# Altium project S3220B.PrjPcb
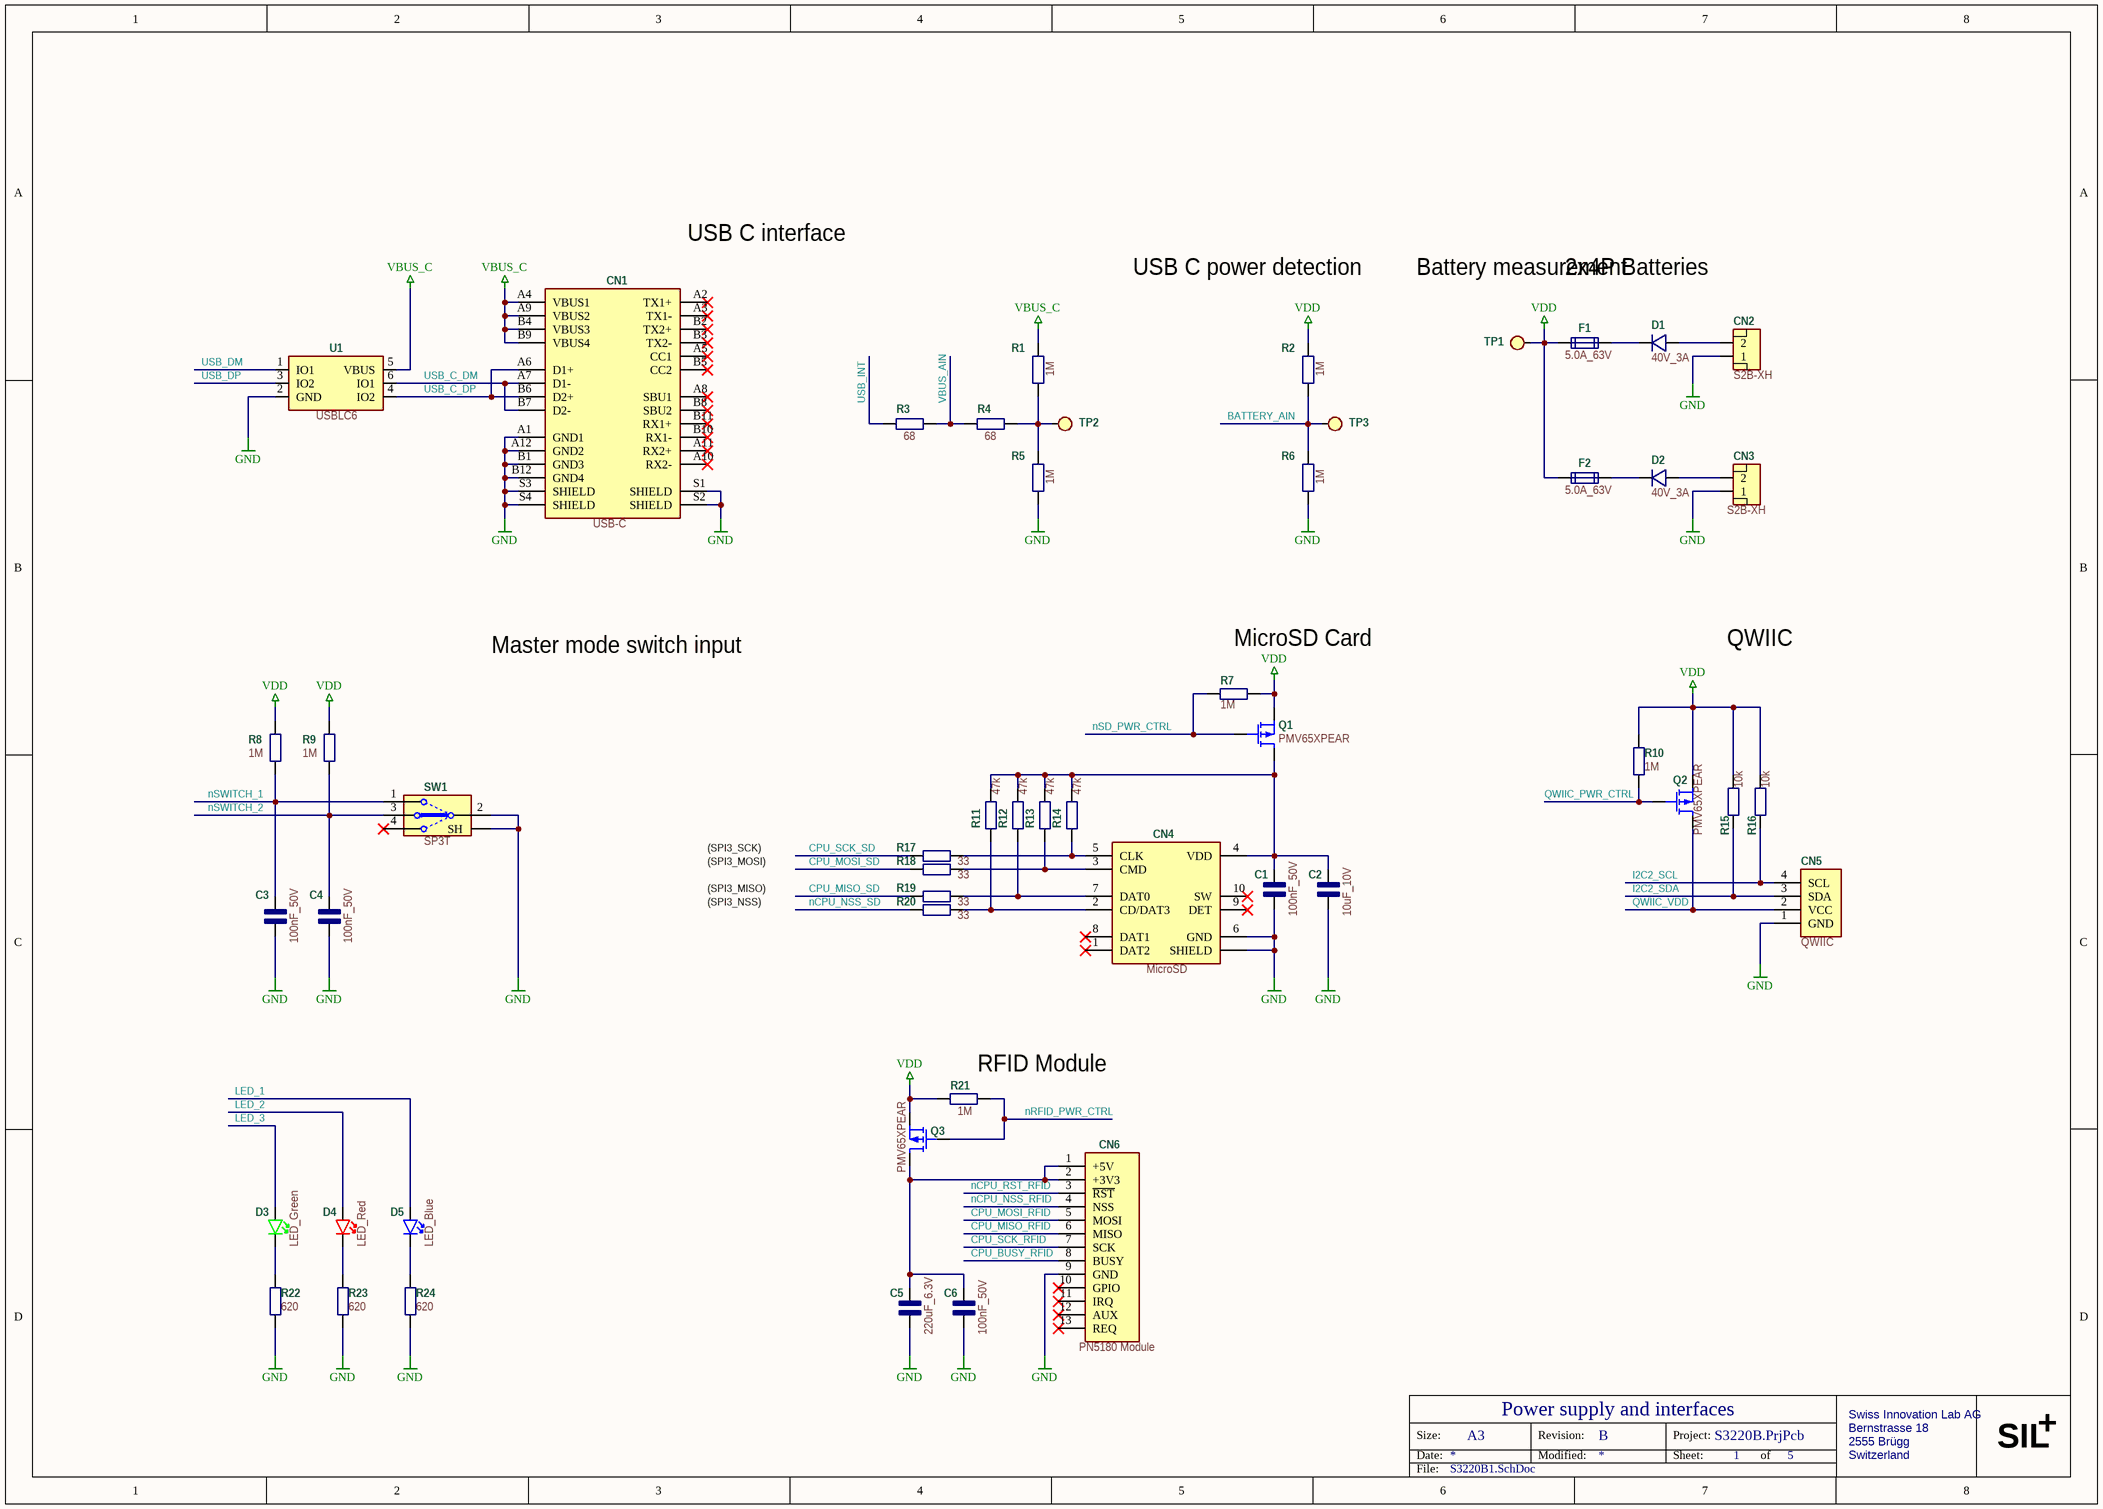
[diagram p0: S3220B1.SchDoc]
4 sheets, 235 parts. Net scope: global (net labels, ports and power ports of the same name join across sheets).
Board files: S3220B.PcbDoc, Panelized_S3220B.PcbDoc
Sheets:
  S3220B1.SchDoc
  S3220B2.SchDoc
  S3220B3.SchDoc
  S3220B4.SchDoc

## Sheet S3220B1.SchDoc: Power supply and interfaces
size A3; Revision: B; SheetNumber: 1; SheetTotal: 5

### Parts
C1  100nF_50V  [C_0603]
C2  10uF_10V  [C_0603]
C3  100nF_50V  [C_0603]
C4  100nF_50V  [C_0603]
C5  220uF_6.3V  [C_1206]
C6  100nF_50V  [C_0603]
CN1  USB-C  [CN_USB-C-RA_2]
CN2  S2B-XH  [CN_S2B-XH-A]
CN3  S2B-XH  [CN_S2B-XH-A]
CN4  MicroSD  [CN_MicroSD-Holder]
CN5  QWIIC  [CN_SM04B-SRSS-TB]
CN6  PN5180 Module  [CN_RFID-PN5180]  (no BOM)
D1  40V_3A  [D_DO-214AC]
D2  40V_3A  [D_DO-214AC]
D3  LED_Green  [LED_2-SMD_4x4]
D4  LED_Red  [LED_2-SMD_4x4]
D5  LED_Blue  [LED_2-SMD_4x4]
F1  5.0A_63V  [F_1206]
F2  5.0A_63V  [F_1206]
Q1  PMV65XPEAR  [U_SOT23-3]
Q2  PMV65XPEAR  [U_SOT23-3]
Q3  PMV65XPEAR  [U_SOT23-3]
R1  1M  [R_0603]
R2  1M  [R_0603]
R3  68  [R_0603]
R4  68  [R_0603]
R5  1M  [R_0603]
R6  1M  [R_0603]
R7  1M  [R_0603]
R8  1M  [R_0603]
R9  1M  [R_0603]
R10  1M  [R_0603]
R11  47k  [R_0603]
R12  47k  [R_0603]
R13  47k  [R_0603]
R14  47k  [R_0603]
R15  10k  [R_0603]
R16  10k  [R_0603]
R17  33  [R_0603]
R18  33  [R_0603]
R19  33  [R_0603]
R20  33  [R_0603]
R21  1M  [R_0603]
R22  620  [R_0603]
R23  620  [R_0603]
R24  620  [R_0603]
SW1  SP3T  [SW_SLIDE-SP3T]
TP1  Test point  [TP_SMD_R1.0mm]  (value not drawn)  (no BOM)
TP2  Test point  [TP_SMD_R1.0mm]  (value not drawn)  (no BOM)
TP3  Test point  [TP_SMD_R1.0mm]  (value not drawn)  (no BOM)
U1  USBLC6  [U_SOT23-6]

### Nets
GND: C1.1 C2.1 C3.1 C4.1 C5.1 C6.1 CN1.A1(GND1) CN1.A12(GND2) CN1.B1(GND3) CN1.B12(GND4) CN1.S1(SHIELD) CN1.S2(SHIELD) CN1.S3(SHIELD) CN1.S4(SHIELD) CN2.1 CN3.1 CN4.0(SHIELD) CN4.6(GND) CN5.1(GND) CN6.9(GND) R5.1 R6.1 R22.2 R23.2 R24.2 SW1.0(SH) SW1.2 U1.2(GND)
VBUS_C: CN1.A4(VBUS1) CN1.A9(VBUS2) CN1.B4(VBUS3) CN1.B9(VBUS4) R1.2 U1.5(VBUS)
VDD: F1.1 F2.1 Q1.2(S) Q2.2(S) Q3.2(S) R2.2 R7.1 R8.2 R9.2 R10.2 R15.2 R16.2 R21.1 TP1.1
BATTERY_AIN: R2.1 R6.2 TP3.1
CPU_BUSY_RFID: CN6.8(BUSY)
CPU_MISO_RFID: CN6.6(MISO)
CPU_MISO_SD: R19.1
CPU_MOSI_RFID: CN6.5(MOSI)
CPU_MOSI_SD: R18.1
CPU_SCK_RFID: CN6.7(SCK)
CPU_SCK_SD: R17.1
I2C2_SCL: CN5.4(SCL) R16.1
I2C2_SDA: CN5.3(SDA) R15.1
LED_1: D5.1(A)
LED_2: D4.1(A)
LED_3: D3.1(A)
nCPU_NSS_RFID: CN6.4(NSS)
nCPU_NSS_SD: R20.1
nCPU_RST_RFID: CN6.3(~{RST})
nRFID_PWR_CTRL: Q3.1(G) R21.2
nSD_PWR_CTRL: Q1.1(G) R7.2
nSWITCH_1: C3.2 R8.1 SW1.1
nSWITCH_2: C4.2 R9.1 SW1.3
QWIIC_PWR_CTRL: Q2.1(G) R10.1
QWIIC_VDD: CN5.2(VCC) Q2.3(D)
USB_C_DM: CN1.A7(D1-) CN1.B7(D2-) U1.6(IO1)
USB_C_DP: CN1.A6(D1+) CN1.B6(D2+) U1.4(IO2)
USB_DM: U1.1(IO1)
USB_DP: U1.3(IO2)
USB_INT: R3.1
VBUS_AIN: R3.2 R4.1
NetC1_2: C1.2 C2.2 CN4.4(VDD) Q1.3(D) R11.2 R12.2 R13.2 R14.2
NetC5_2: C5.2 C6.2 CN6.1(+5V) CN6.2(+3V3) Q3.3(D)
NetCN2_2: CN2.2 D1.A
NetCN3_2: CN3.2 D2.A
NetCN4_2: CN4.2(CD/DAT3) R11.1 R20.2
NetCN4_3: CN4.3(CMD) R13.1 R18.2
NetCN4_5: CN4.5(CLK) R14.1 R17.2
NetCN4_7: CN4.7(DAT0) R12.1 R19.2
NetD1_K: D1.K F1.2
NetD2_K: D2.K F2.2
NetD3_2: D3.2(K) R22.1
NetD4_2: D4.2(K) R23.1
NetD5_2: D5.2(K) R24.1
NetR1_1: R1.1 R4.2 R5.2 TP2.1

Not connected (* = marked no-connect by the designer): CN1 A2(TX1+)* A3(TX1-)* A5(CC1)* A8(SBU1)* A10(RX2-)* A11(RX2+)* B2(TX2+)* B3(TX2-)* B5(CC2)* B8(SBU2)* B10(RX1-)* B11(RX1+)*; CN4 1(DAT2)* 8(DAT1)* 9(DET)* 10(SW)* X1 X2; CN6 10(GPIO)* 11(IRQ)* 12(AUX)* 13(REQ)*; SW1 4*

### Notes on the sheet
- USB C interface
- USB C power detection
- Battery measurement
- 2x4P Batteries
- (near R7) MicroSD Card
- QWIIC
- Master mode switch input
- (SPI3_SCK)
- (SPI3_NSS)
- (SPI3_MISO)
- (SPI3_MOSI)
- (near R21) RFID Module
- Size:
- Date:
- A3
- Revision:
- Modified:
- Project:
- Sheet:
- of
- Swiss Innovation Lab AG
- Bernstrasse 18
- 2555 Brügg
- Switzerland
- SIL
- +
- File:

### Library data of the parts
C1 C3 C4 C6 = C_100nF_50V: 0.1µF ±10% 50V Ceramic Capacitor X7R 0603 (1608 Metric); Manufacturer: TDK; Manufacturer Part Number: C1608X7R1H104K080AA; Value: 100nF; ValueAux: _50V; Currency: $; Price: 0,01309; Supplier 1: Digi-Key; Supplier Part Number 1: 445-1314-6-ND
C2 = C_10uF_10V: 10µF ±10% 10V Ceramic Capacitor X5R 0603 (1608 Metric); Manufacturer: Murata Electronics North America; Manufacturer Part Number: GRM188R61A106KE69D; Value: 10uF; ValueAux: _10V; Currency: $; Price: 0,03994; Supplier 1: Digi-Key; Supplier Part Number 1: 490-10474-1-ND
C5 = C_220uF_6.3V: 220µF ±20% 6.3V Ceramic Capacitor X5R 1206 (3216 Metric); Manufacturer: Murata Electronics North America; Manufacturer Part Number: GRM31CR60J227ME11L; Value: 220uF; ValueAux: _6.3V; Currency: $; Price: 0,59945; Supplier 1: Digi-Key; Supplier Part Number 1: 490-13970-1-ND
CN1 = CN_USB-C-RA_2: USB-C (USB TYPE-C) USB 3.2 Gen 2 (USB 3.1 Gen 2, Superspeed + (USB 3.1)) Receptacle Connector 24 Position Surface Mount, Right Angle; Through Hole; Manufacturer: CUI Devices; Manufacturer Part Number: UJ31-CH-G-SMT-TR-67; Currency: $; Value: USB-C; Price: 2,43252; Supplier 1: Digi-Key; Supplier Part Number 1: 2223-UJ31-CH-G-SMT-TR-67CT-ND
CN2 CN3 = CN_S2B-XH: Connector Header Through Hole, Right Angle 2 position 0.098" (2.50mm); Manufacturer: JST Sales America Inc.; Manufacturer Part Number: S2B-XH-A(LF)(SN); Currency: $; Supplier 1: Digi-Key; Supplier Part Number 1: 455-2257-ND; Value: S2B-XH; Price: 0,07792
CN4 = CN_MicroSD-Holder: 10 (8 + 2) Position Card Connector Secure Digital microSD Surface Mount, Right Angle Gold; Manufacturer: Molex; Manufacturer Part Number: 5031821852; Currency: $; Value: MicroSD; Price: 2,94830; Supplier 1: Digi-Key; Supplier Part Number 1: WM12834CT-ND
CN5 = CN_QWICC: Connector Header Surface Mount, Right Angle 4 position 0.039" (1.00mm); Manufacturer: JST Sales America Inc.; Manufacturer Part Number: SM04B-SRSS-TB(LF)(SN); Currency: $; Supplier 1: Digi-Key; Supplier Part Number 1: 455-1804-1-ND; Value: QWIIC; Price: 0,61
CN6 = CN_RFID-PN5180: RFID Module PN5180; Manufacturer: Swiss Innovation Lab; Currency: $; Manufacturer Part Number: RFID-PN5180; Supplier 1: Swiss Innovation Lab; Supplier Part Number 1: RFID-PN5180; Value: PN5180 Module; Price: 5
D1 D2 = D_40V_3A: Diode Schottky 40V 3A Surface Mount DO-214AC (SMA); Manufacturer: Comchip Technology; Manufacturer Part Number: CDBA340L-HF; ValueAux: _3A; Currency: $; Value: 40V; Price: 0,25740; Supplier 1: Digi-Key; Supplier Part Number 1: 641-1702-6-ND
D3 = D_LED_G_2mA: Green 570nm LED Indication - Discrete 1.8V 2-SMD, Boomerang; Manufacturer: OSRAM Opto Semiconductors Inc.; Manufacturer Part Number: LG A67K-G2K1-24-0-2-R33-Z; ValueAux: _Green; Currency: $; Value: LED; Price: 0,10408; Supplier 1: Digi-Key; Supplier Part Number 1: 475-LGA67K-G2K1-24-0-2-R33-ZTR-ND
D4 = D_LED_R_2mA: Red 630nm LED Indication - Discrete 1.8V 2-SMD, Boomerang; Manufacturer: OSRAM Opto Semiconductors Inc.; Manufacturer Part Number: LS A67K-J1K2-1-Z; ValueAux: _Red; Currency: $; Value: LED; Price: 0,10626; Supplier 1: Digi-Key; Supplier Part Number 1: 475-3123-1-ND
D5 = D_LED_B_10mA: Blue 471nm LED Indication - Discrete 3.1V 2-SMD, Boomerang; Manufacturer: OSRAM Opto Semiconductors Inc.; Manufacturer Part Number: LB A673-L2N1-35-Z; ValueAux: _Blue; Currency: $; Value: LED; Price: 0,11695; Supplier 1: Digi-Key; Supplier Part Number 1: LBA673-L2N1-35-Z-ND
F1 F2 = F_5A_63V: FUSE BOARD MNT 5A 63VAC/VDC 1206; Manufacturer: Bel Fuse Inc.; Manufacturer Part Number: C1S 5; Value: 5.0A; ValueAux: _63V; Currency: $; Price: 0,17995; Supplier 1: Digi-Key; Supplier Part Number 1: 507-1194-1-ND
Q1-Q3 = Q_PMV65: P-Channel 20V 2.8A (Ta) 480mW (Ta), 6.25W (Tc) Surface Mount TO-236AB (SOT23); Manufacturer: Nexperia USA Inc.; Currency: $; Value: PMV65XPEAR; Manufacturer Part Number: PMV65XPEAR; Price: 0,11204; Supplier 1: Digi-Key; Supplier Part Number 1: 1727-2310-1-ND
R1 R2 R5-R10 R21 = R_1M_1%: 1 MOhms ±1% 0.1W, 1/10W Chip Resistor 0603 (1608 Metric) Automotive AEC-Q200 Thick Film; Manufacturer: Panasonic Electronic Components; Manufacturer Part Number: ERJ-3EKF1004V; Currency: $; Value: 1M; Price: 0,01264; Supplier 1: Digi-Key; Supplier Part Number 1: P1.00MHCT-ND
R3 R4 = R_68_1%: 68 Ohms ±1% 0.1W, 1/10W Chip Resistor 0603 (1608 Metric) Automotive AEC-Q200 Thick Film; Manufacturer: Panasonic Electronic Components; Manufacturer Part Number: ERJ-3EKF68R0V; Currency: $; Value: 68; Price: 0,01449; Supplier 1: Digi-Key; Supplier Part Number 1: P68.0HCT-ND
R11-R14 = R_47k_1%: 47 kOhms ±1% 0.1W, 1/10W Chip Resistor 0603 (1608 Metric) Automotive AEC-Q200 Thick Film; Manufacturer: Panasonic Electronic Components; Manufacturer Part Number: ERJ-3EKF4702V; Currency: $; Value: 47k; Price: 0,00670; Supplier 1: Digi-Key; Supplier Part Number 1: P47.0KHCT-ND
R15 R16 = R_10k_1%: 10 kOhms ±1% 0.1W, 1/10W Chip Resistor 0603 (1608 Metric) Automotive AEC-Q200 Thick Film; Manufacturer: Panasonic Electronic Components; Manufacturer Part Number: ERJ-3EKF1002V; Currency: $; Value: 10k; Price: 0,01449; Supplier 1: Digi-Key; Supplier Part Number 1: P10.0KHCT-ND
R17-R20 = R_33_1%: 33 Ohms ±1% 0.1W, 1/10W Chip Resistor 0603 (1608 Metric) Automotive AEC-Q200 Thick Film; Manufacturer: Panasonic Electronic Components; Manufacturer Part Number: ERJ-3EKF33R0V; Currency: $; Value: 33; Price: 0,01449; Supplier 1: Digi-Key; Supplier Part Number 1: P33.0HCT-ND
R22-R24 = R_620_1%: 620 Ohms ±1% 0.1W, 1/10W Chip Resistor 0603 (1608 Metric) Automotive AEC-Q200 Thick Film; Manufacturer: Panasonic Electronic Components; Manufacturer Part Number: ERJ-3EKF6200V; Currency: $; Value: 620; Price: 0,01273; Supplier 1: Digi-Key; Supplier Part Number 1: P620HCT-ND
SW1 = SW_SP3T_Slide: Slide Switch SP3T Through Hole, Right Angle; Manufacturer: C&K; Manufacturer Part Number: OS103011MA7QP1; Currency: $; Value: SP3T; Price: 0,42483; Supplier 1: Digi-Key; Supplier Part Number 1: CKN9561-ND
TP1-TP3 = TP_Test_point: Manufacturer: Swiss Innovation Lab; Currency: $; Value: Test point; Manufacturer Part Number: Test point; Price: 0
U1 = U_USBLC6: TVS DIODE 5.25V 17V SOT23-6; Manufacturer: STMicroelectronics; Manufacturer Part Number: USBLC6-2SC6Y; Currency: $; Value: USBLC6; Price: 0,33501; Supplier 1: Digi-Key; Supplier Part Number 1: 497-11882-6-ND

## Sheet S3220B2.SchDoc: CPU
size A3; Revision: B; SheetNumber: 2; SheetTotal: 5
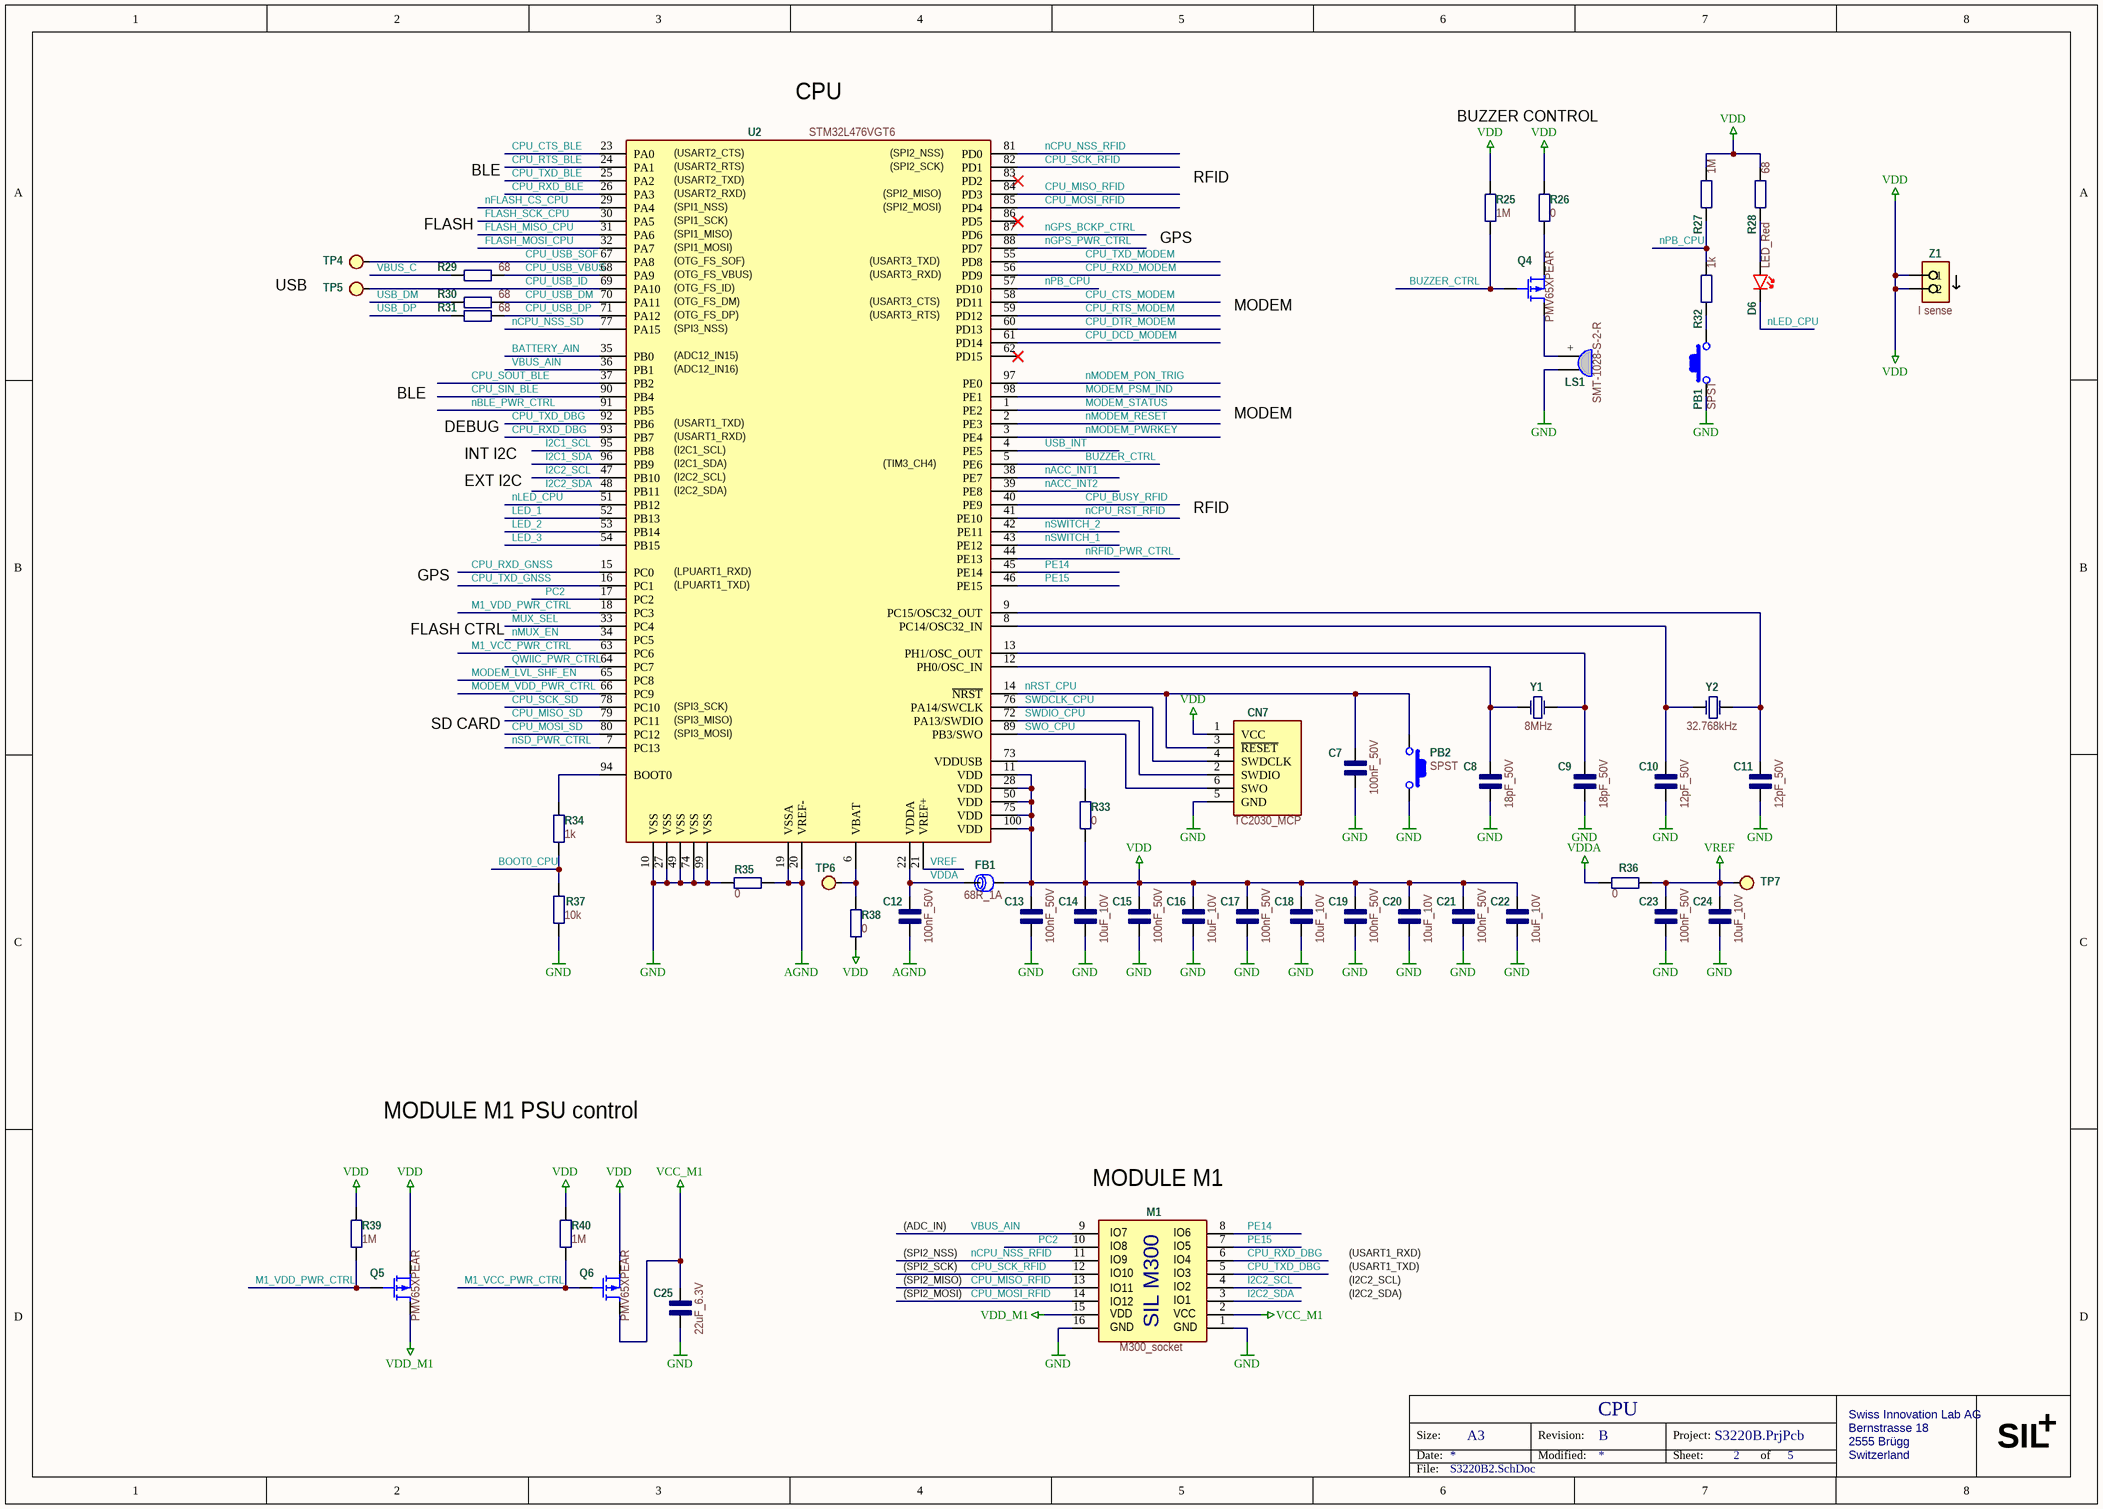
[diagram p1: S3220B2.SchDoc]

### Parts
C7  100nF_50V  [C_0603]
C8  18pF_50V  [C_0603]
C9  18pF_50V  [C_0603]
C10  12pF_50V  [C_0603]
C11  12pF_50V  [C_0603]
C12  100nF_50V  [C_0603]
C13  100nF_50V  [C_0603]
C14  10uF_10V  [C_0603]
C15  100nF_50V  [C_0603]
C16  10uF_10V  [C_0603]
C17  100nF_50V  [C_0603]
C18  10uF_10V  [C_0603]
C19  100nF_50V  [C_0603]
C20  10uF_10V  [C_0603]
C21  100nF_50V  [C_0603]
C22  10uF_10V  [C_0603]
C23  100nF_50V  [C_0603]
C24  10uF_10V  [C_0603]
C25  22uF_6.3V  [C_0603]
CN7  TC2030_MCP  [CN_TC2030-MCP-NL]  (no BOM)
D6  LED_Red  [LED_0603]
FB1  68R_1A  [L_0603]
LS1  SMT-1028-S-2-R  [LS_SMT-1028-S-2-R]
M1  M300_socket  [M_M300_socket]  (no BOM)
PB1  SPST  [PB_PTS810]
PB2  SPST  [PB_PTS810]
Q4  PMV65XPEAR  [U_SOT23-3]
Q5  PMV65XPEAR  [U_SOT23-3]
Q6  PMV65XPEAR  [U_SOT23-3]
R25  1M  [R_0603]
R26  0  [R_0603]
R27  1M  [R_0603]
R28  68  [R_0603]
R29  68  [R_0603]
R30  68  [R_0603]
R31  68  [R_0603]
R32  1k  [R_0603]
R33  0  [R_0603]
R34  1k  [R_0603]
R35  0  [R_0603]
R36  0  [R_0603]
R37  10k  [R_0603]
R38  0  [R_0603]
R39  1M  [R_0603]
R40  1M  [R_0603]
TP4  Test point  [TP_SMD_R1.0mm]  (value not drawn)  (no BOM)
TP5  Test point  [TP_SMD_R1.0mm]  (value not drawn)  (no BOM)
TP6  Test point  [TP_SMD_R1.0mm]  (value not drawn)  (no BOM)
TP7  Test point  [TP_SMD_R1.0mm]  (value not drawn)  (no BOM)
U2  STM32L476VGT6  [U_100-LQFP]
Y1  8MHz  [Y_ABMM2]
Y2  32.768kHz  [Y_XTAL-3215]
Z1  I sense  [Z_I_SENSE]  (no BOM)

### Nets
AGND: C12.1 R35.2 U2.19(VSSA) U2.20(VREF-)
GND: C7.1 C8.1 C9.1 C10.1 C11.1 C13.1 C14.1 C15.1 C16.1 C17.1 C18.1 C19.1 C20.1 C21.1 C22.1 C23.1 C24.1 C25.1 CN7.5(GND) LS1.2(-) M1.1(GND) M1.16(GND) PB1.2 PB2.1 R35.1 R37.1 U2.10(VSS) U2.27(VSS) U2.49(VSS) U2.74(VSS) U2.99(VSS)
VBUS_C: R29.1
VCC_M1: C25.2 M1.2(5V) Q6.3(D)
VDD: C13.2 C14.2 C15.2 C16.2 C17.2 C18.2 C19.2 C20.2 C21.2 C22.2 CN7.1(VCC) FB1.2 Q5.2(S) Q6.2(S) R25.2 R26.1 R27.1 R28.2 R33.2 R38.1 R39.2 R40.1 U2.11(VDD) U2.28(VDD) U2.50(VDD) U2.75(VDD) U2.100(VDD) Z1.1 Z1.2
VDD_M1: M1.15(3.3V) Q5.3(D)
VDDA: C12.2 FB1.1 R36.2 U2.22(VDDA)
VREF: C23.2 C24.2 R36.1 TP7.1 U2.21(VREF+)
BATTERY_AIN: U2.35(PB0)
BOOT0_CPU: R34.1 R37.2
BUZZER_CTRL: Q4.1(G) R25.1 U2.5(PE6)
CPU_BUSY_RFID: U2.40(PE9)
CPU_CTS_BLE: U2.23(PA0)
CPU_CTS_MODEM: U2.58(PD11)
CPU_DCD_MODEM: U2.61(PD14)
CPU_DTR_MODEM: U2.60(PD13)
CPU_MISO_RFID: M1.13(MISO) U2.84(PD3)
CPU_MISO_SD: U2.79(PC11)
CPU_MOSI_RFID: M1.14(MOSI) U2.85(PD4)
CPU_MOSI_SD: U2.80(PC12)
CPU_RTS_BLE: U2.24(PA1)
CPU_RTS_MODEM: U2.59(PD12)
CPU_RXD_BLE: U2.26(PA3)
CPU_RXD_DBG: M1.6(RX) U2.93(PB7)
CPU_RXD_GNSS: U2.15(PC0)
CPU_RXD_MODEM: U2.56(PD9)
CPU_SCK_RFID: M1.12(SCK) U2.82(PD1)
CPU_SCK_SD: U2.78(PC10)
CPU_SIN_BLE: U2.90(PB4)
CPU_SOUT_BLE: U2.37(PB2)
CPU_TXD_BLE: U2.25(PA2)
CPU_TXD_DBG: M1.5(TX) U2.92(PB6)
CPU_TXD_GNSS: U2.16(PC1)
CPU_TXD_MODEM: U2.55(PD8)
CPU_USB_DM: R30.2 U2.70(PA11)
CPU_USB_DP: R31.2 U2.71(PA12)
CPU_USB_ID: TP5.1 U2.69(PA10)
CPU_USB_SOF: TP4.1 U2.67(PA8)
CPU_USB_VBUS: R29.2 U2.68(PA9)
FLASH_MISO_CPU: U2.31(PA6)
FLASH_MOSI_CPU: U2.32(PA7)
FLASH_SCK_CPU: U2.30(PA5)
I2C1_SCL: U2.95(PB8)
I2C1_SDA: U2.96(PB9)
I2C2_SCL: M1.4(SCL) U2.47(PB10)
I2C2_SDA: M1.3(SDA) U2.48(PB11)
LED_1: U2.52(PB13)
LED_2: U2.53(PB14)
LED_3: U2.54(PB15)
M1_VCC_PWR_CTRL: Q6.1(G) R40.2 U2.63(PC6)
M1_VDD_PWR_CTRL: Q5.1(G) R39.1 U2.18(PC3)
MODEM_LVL_SHF_EN: U2.65(PC8)
MODEM_PSM_IND: U2.98(PE1)
MODEM_STATUS: U2.1(PE2)
MODEM_VDD_PWR_CTRL: U2.66(PC9)
MUX_SEL: U2.33(PC4)
nACC_INT1: U2.38(PE7)
nACC_INT2: U2.39(PE8)
nBLE_PWR_CTRL: U2.91(PB5)
nCPU_NSS_RFID: M1.11(CS) U2.81(PD0)
nCPU_NSS_SD: U2.77(PA15)
nCPU_RST_RFID: U2.41(PE10)
nFLASH_CS_CPU: U2.29(PA4)
nGPS_BCKP_CTRL: U2.87(PD6)
nGPS_PWR_CTRL: U2.88(PD7)
nLED_CPU: D6.2(K) U2.51(PB12)
nMODEM_PON_TRIG: U2.97(PE0)
nMODEM_PWRKEY: U2.3(PE4)
nMODEM_RESET: U2.2(PE3)
nMUX_EN: U2.34(PC5)
nPB_CPU: R27.2 R32.2 U2.57(PD10)
nRFID_PWR_CTRL: U2.44(PE13)
nRST_CPU: C7.2 CN7.3(~{RESET}) PB2.2 U2.14(~{NRST})
nSD_PWR_CTRL: U2.7(PC13)
nSWITCH_1: U2.43(PE12)
nSWITCH_2: U2.42(PE11)
PC2: M1.10(RST) U2.17(PC2)
PE14: M1.8(PWM) U2.45(PE14)
PE15: M1.7(INT) U2.46(PE15)
QWIIC_PWR_CTRL: U2.64(PC7)
SWDCLK_CPU: CN7.4(SWDCLK) U2.76(PA14/SWCLK)
SWDIO_CPU: CN7.2(SWDIO) U2.72(PA13/SWDIO)
SWO_CPU: CN7.6(SWO) U2.89(PB3/SWO)
USB_DM: R30.1
USB_DP: R31.1
USB_INT: U2.4(PE5)
VBUS_AIN: M1.9(AN) U2.36(PB1)
NetC8_2: C8.2 U2.12(PH0/OSC_IN) Y1.1(inp)
NetC9_2: C9.2 U2.13(PH1/OSC_OUT) Y1.3(out)
NetC10_2: C10.2 U2.8(PC14/OSC32_IN) Y2.1(inp)
NetC11_2: C11.2 U2.9(PC15/OSC32_OUT) Y2.2(out)
NetD6_1: D6.1(A) R28.1
NetLS1_1: LS1.1(+) Q4.3(D)
NetPB1_1: PB1.1 R32.1
NetQ4_2: Q4.2(S) R26.2
NetR33_1: R33.1 U2.73(VDDUSB)
NetR34_2: R34.2 U2.94(BOOT0)
NetR38_2: R38.2 TP6.1 U2.6(VBAT)

Not connected (* = marked no-connect by the designer): U2 62(PD15)* 83(PD2)* 86(PD5)*

### Notes on the sheet
- (near U2) CPU
- BLE
- (near U2) (USART2_TXD)
- (near U2) (USART2_CTS)
- (near U2) (USART2_RTS)
- (near U2) (SPI2_SCK)
- (near U2) (SPI2_NSS)
- RFID
- BUZZER CONTROL
- (near R29) FLASH
- (near U2) (USART2_RXD)
- (near U2) (SPI1_MISO)
- (near U2) (SPI1_SCK)
- (near U2) (SPI1_NSS)
- (near U2) (SPI2_MOSI)
- (near U2) (SPI2_MISO)
- GPS
- USB
- (near U2) (SPI1_MOSI)
- (near U2) (OTG_FS_DM)
- (near U2) (OTG_FS_DP)
- (near U2) (OTG_FS_SOF)
- (near U2) (OTG_FS_VBUS)
- (near U2) (OTG_FS_ID)
- (near U2) (USART3_CTS)
- (near U2) (USART3_RTS)
- (near U2) (USART3_TXD)
- (near U2) (USART3_RXD)
- MODEM
- (near U2) (SPI3_NSS)
- (near U2) (ADC12_IN15)
- (near U2) (ADC12_IN16)
- DEBUG
- (near U2) (USART1_TXD)
- (near U2) (USART1_RXD)
- (near U2) (I2C1_SCL)
- INT I2C
- EXT I2C
- (near U2) (I2C2_SCL)
- (near U2) (I2C2_SDA)
- (near U2) (I2C1_SDA)
- (near U2) (TIM3_CH4)
- (near U2) (LPUART1_TXD)
- (near U2) (LPUART1_RXD)
- FLASH CTRL
- (near U2) (SPI3_SCK)
- (near U2) (SPI3_MISO)
- SD CARD
- (near U2) (SPI3_MOSI)
- MODULE M1 PSU control
- (near M1) MODULE M1
- (SPI2_NSS)
- (ADC_IN)
- (USART1_RXD)
- (SPI2_SCK)
- (SPI2_MISO)
- (SPI2_MOSI)
- (I2C2_SCL)
- (I2C2_SDA)
- (USART1_TXD)
- Size:
- Date:
- A3
- Revision:
- Modified:
- Project:
- Sheet:
- of
- Swiss Innovation Lab AG
- Bernstrasse 18
- 2555 Brügg
- Switzerland
- SIL
- +
- File:
- (in symbol M_M300_socket) IO7; IO6; IO8; IO5; IO9; IO4; IO10; IO3; IO11; IO2; IO12; IO1; VDD; VCC; SIL M300

### Library data of the parts
C7 C12 C13 C15 C17 C19 C21 C23 = C_100nF_50V: as C1 on sheet S3220B1; Price: 0,01309; Supplier 1: Digi-Key; Supplier Part Number 1: 445-1314-6-ND
C8 C9 = C_18pF_50V: 18pF ±5% 50V Ceramic Capacitor C0G, NP0 0603 (1608 Metric); Manufacturer: KEMET; Manufacturer Part Number: C0603C180J5GACTU; ValueAux: _50V; Currency: $; Value: 18pF; Price: 0,00974; Supplier 1: Digi-Key; Supplier Part Number 1: 399-1052-1-ND
C10 C11 = C_12pF_50V: 12pF ±1% 50V Ceramic Capacitor C0G, NP0 0603 (1608 Metric); Manufacturer: Samsung Electro-Mechanics; Manufacturer Part Number: CL10C120FB8NNNC; ValueAux: _50V; Currency: $; Value: 12pF; Price: 0,05153; Supplier 1: Digi-Key; Supplier Part Number 1: 1276-2175-1-ND
C14 C16 C18 C20 C22 C24 = C_10uF_10V: as C2 on sheet S3220B1; Price: 0,03994; Supplier 1: Digi-Key; Supplier Part Number 1: 490-10474-1-ND
C25 = C_22uF_6V3: 22µF ±20% 6.3V Ceramic Capacitor X5R 0603 (1608 Metric); Manufacturer: Samsung Electro-Mechanics; Manufacturer Part Number: CL10A226MQ8NRNC; Value: 22uF; ValueAux: _6.3V; Currency: $; Price: 0,04566; Supplier 1: Digi-Key; Supplier Part Number 1: 1276-1193-1-ND
CN7 = CN_TC2030: TC2030-MCP-NL; Value: TC2030; ValueAux: _MCP; Currency: $; Price: 0
D6 = D_LED_R_5mA: Red 631nm LED Indication - Discrete 2V 0603; Manufacturer: Lite-On Inc.; Manufacturer Part Number: LTST-C193KRKT-5A; ValueAux: _Red; Currency: $; Value: LED; Price: 0,07565; Supplier 1: Digi-Key; Supplier Part Number 1: 160-1830-1-ND
FB1 = FB_68R_1A: FERRITE BEAD 68 OHM 0603 1LN; Manufacturer: Laird-Signal Integrity Products; Manufacturer Part Number: MI0603J680R-10; Value: 68R; ValueAux: _1A; Currency: $; Price: 0,02658; Supplier 1: Digi-Key; Supplier Part Number 1: 240-2372-1-ND
LS1 = LS_SMT-1028-S-2-R: Buzzers Transducer, Externally Driven Electromechanical/Magnetic 3.6 V 100mA 2.83kHz 93dB @ 3.6V, 10cm Surface Mount Solder Pads; Manufacturer: PUI Audio, Inc.; Currency: $; Value: SMT-1028-S-2-R; Manufacturer Part Number: SMT-1028-S-2-R; Price: 1,99500; Supplier 1: Digi-Key; Supplier Part Number 1: 668-1531-1-ND
M1 = M_M300_socket: Module M300 motherboard socket; Manufacturer: Swiss Innovation Lab; Currency: $; Value: M300; ValueAux: _socket; Manufacturer Part Number: M300; Price: 0; Supplier 1: Swiss Innovation Lab; Supplier Part Number 1: M300
PB1 PB2 = PB_SPST_2.5mm: Tactile Switch SPST-NO Top Actuated Surface Mount; Manufacturer: C&K; Manufacturer Part Number: PTS810 SJM 250 SMTR LFS; Currency: $; Value: SPST; Price: 0,17302; Supplier 1: Digi-Key; Supplier Part Number 1: CKN10502DKR-ND
Q4-Q6 = Q_PMV65: as Q1 on sheet S3220B1; Value: PMV65XPEAR; Manufacturer Part Number: PMV65XPEAR; Price: 0,11204; Supplier 1: Digi-Key; Supplier Part Number 1: 1727-2310-1-ND
R25 R27 R39 R40 = R_1M_1%: as R1 on sheet S3220B1; Value: 1M; Price: 0,01264; Supplier 1: Digi-Key; Supplier Part Number 1: P1.00MHCT-ND
R26 R33 R35 R36 R38 = R_0_1%: 0 Ohms Jumper 0.1W, 1/10W Chip Resistor 0603 (1608 Metric) Automotive AEC-Q200 Thick Film; Manufacturer: Panasonic Electronic Components; Manufacturer Part Number: ERJ-3GEY0R00V; Currency: $; Value: 0; Price: 0,00962; Supplier 1: Digi-Key; Supplier Part Number 1: P0.0GCT-ND
R28-R31 = R_68_1%: as R3 on sheet S3220B1; Value: 68; Price: 0,01449; Supplier 1: Digi-Key; Supplier Part Number 1: P68.0HCT-ND
R32 R34 = R_1k_1%: 1 kOhms ±1% 0.1W, 1/10W Chip Resistor 0603 (1608 Metric) Automotive AEC-Q200 Thick Film; Manufacturer: Panasonic Electronic Components; Manufacturer Part Number: ERJ-3EKF1001V; Currency: $; Value: 1k; Price: 0,01153; Supplier 1: Digi-Key; Supplier Part Number 1: P1.00KHCT-ND
R37 = R_10k_1%: as R15 on sheet S3220B1; Value: 10k; Price: 0,01449; Supplier 1: Digi-Key; Supplier Part Number 1: P10.0KHCT-ND
TP4-TP7 = TP_Test_point: as TP1 on sheet S3220B1; Value: Test point; Manufacturer Part Number: Test point; Price: 0
U2 = U_STM32L476: ARM® Cortex®-M4 STM32L4 Microcontroller IC 32-Bit 80MHz 1MB (1M x 8) FLASH 100-LQFP (14x14); Manufacturer: STMicroelectronics; Currency: $; Value: STM32L476VGT6; Manufacturer Part Number: STM32L476VGT6; Price: 5,98590; Supplier 1: Digi-Key; Supplier Part Number 1: 497-15873-ND
Y1 = Y_8MHz_20ppm: 8MHz ±20ppm Crystal 18pF 72 Ohms 4-SMD, No Lead; Manufacturer: Abracon LLC; Manufacturer Part Number: ABMM2-8.000MHZ-E2-T; Currency: $; Value: 8MHz; Price: 0,49500; Supplier 1: Digi-Key; Supplier Part Number 1: 535-9628-1-ND
Y2 = Y_32kHz_10ppm: 32.768kHz ±10ppm Crystal 12.5pF 70 kOhms 2-SMD, No Lead; Manufacturer: ECS Inc.; Manufacturer Part Number: ECS-.327-12.5-34B-C-TR; Currency: $; Value: 32.768kHz; Price: 0,42900; Supplier 1: Digi-Key; Supplier Part Number 1: XC1968CT-ND
Z1 = Z_I_sense: 2 Positions Header Connector 0.100" (2.54mm) SMD Gold for current measurement; Manufacturer: SIL; Currency: $; Value: I sense; Manufacturer Part Number: I sense; Price: 0; Supplier 1: SIL; Supplier Part Number 1: I sense

## Sheet S3220B3.SchDoc: Modem BG95
size A3; Revision: B; SheetNumber: 3; SheetTotal: 5
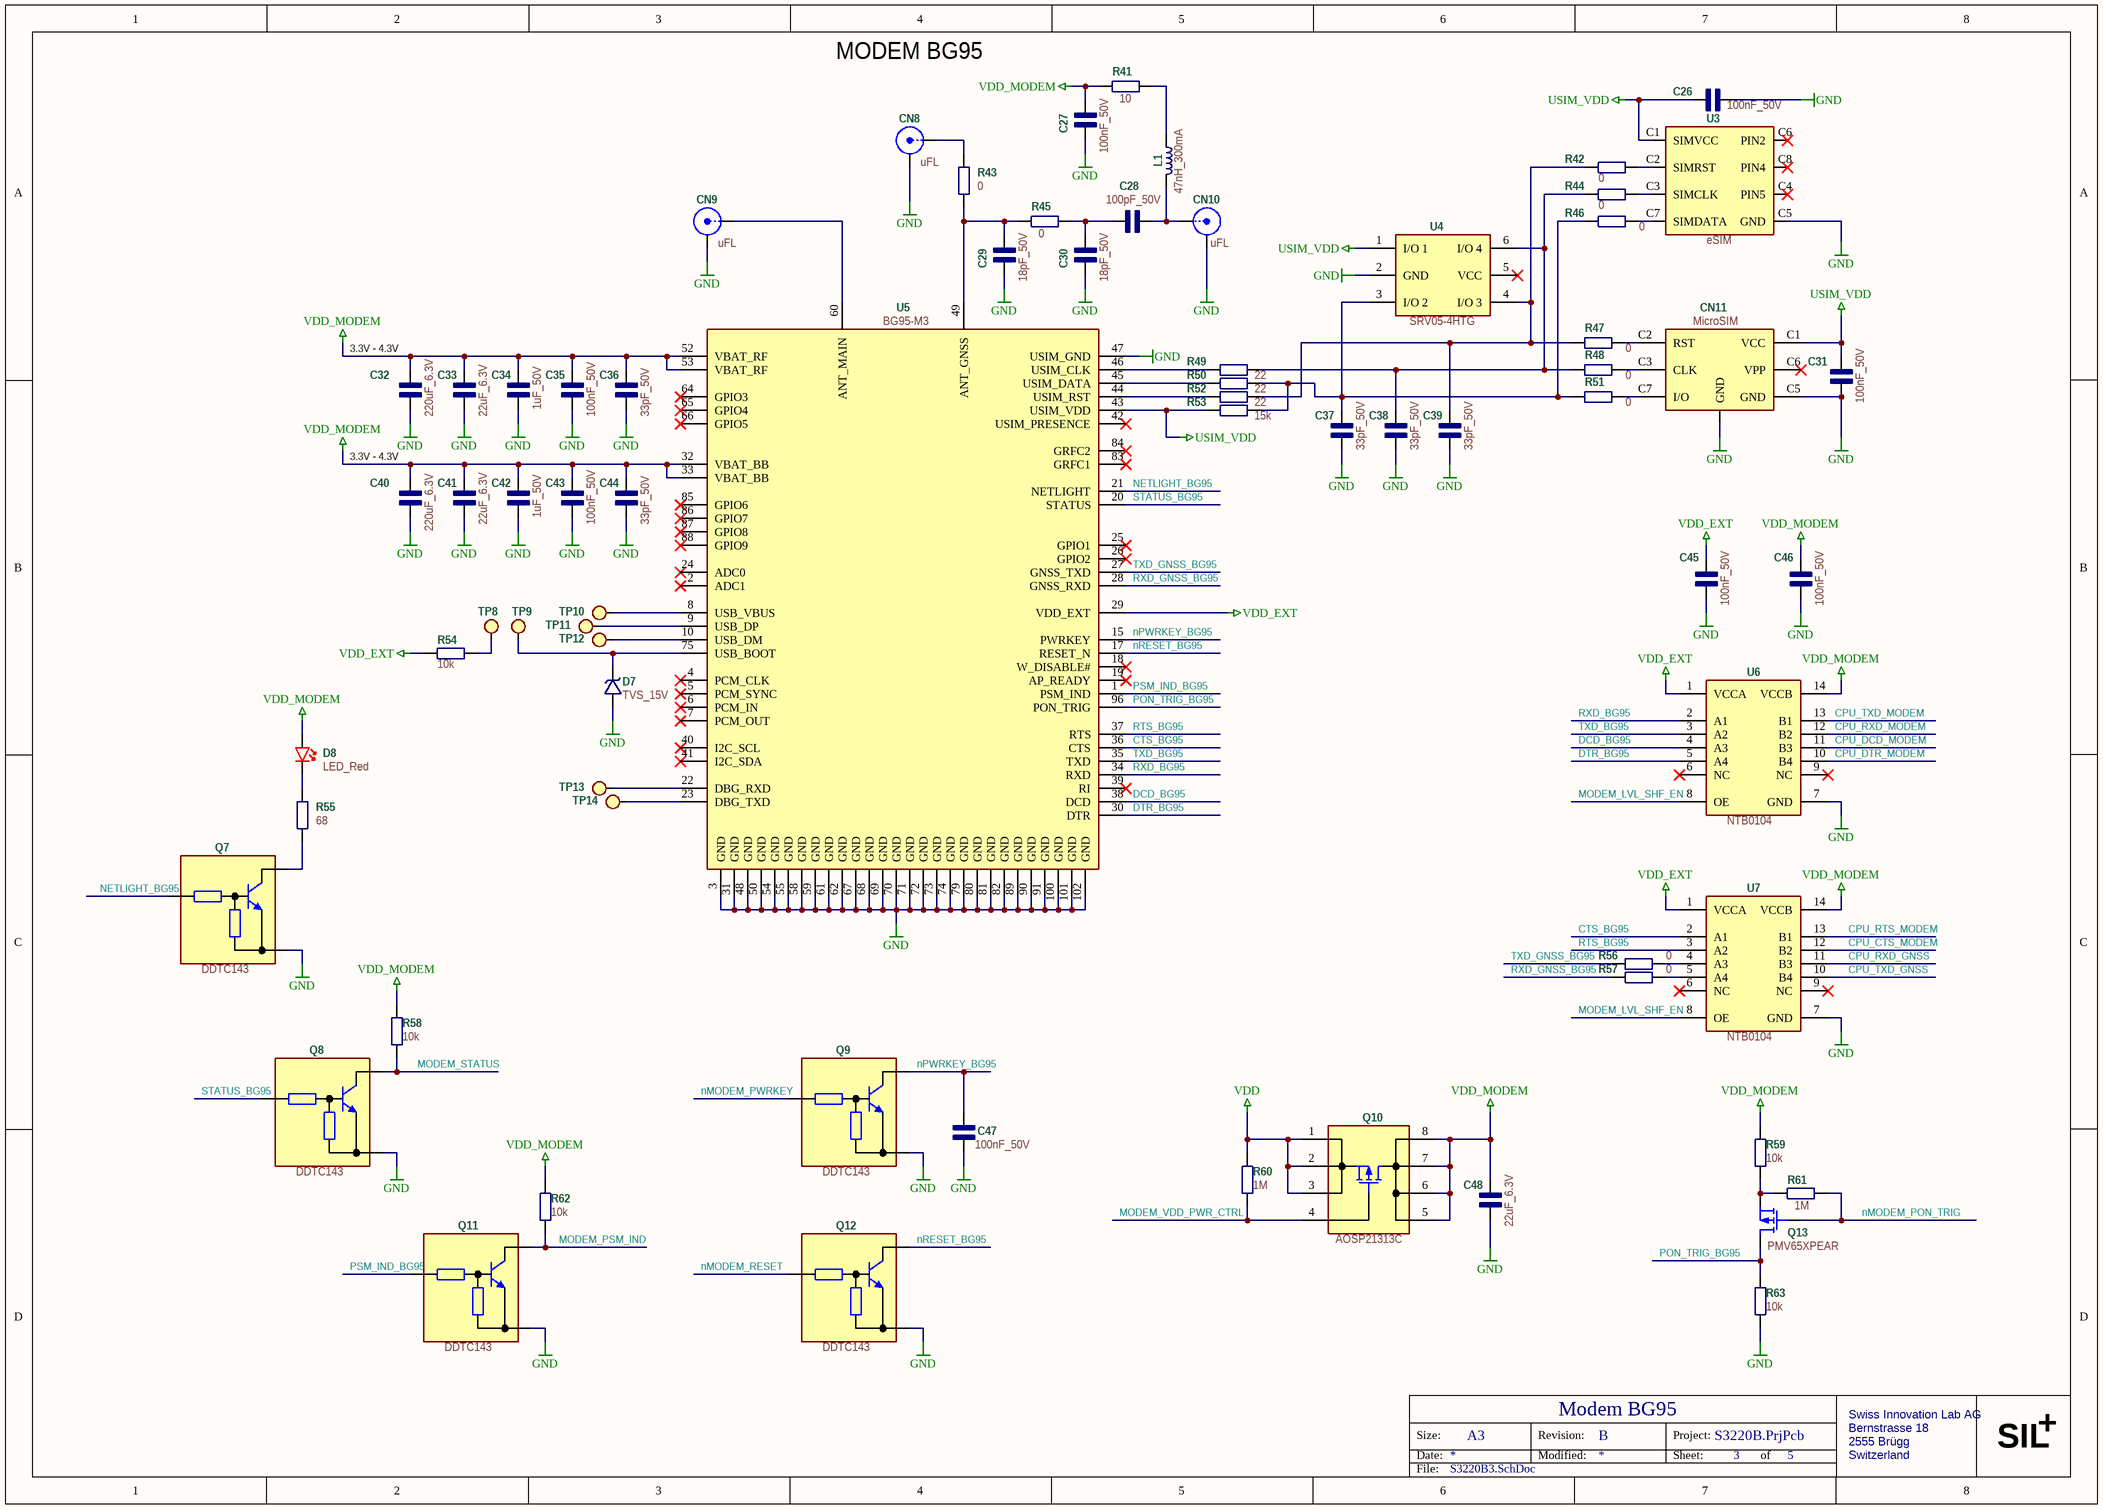
[diagram p2: S3220B3.SchDoc]

### Parts
C26  100nF_50V  [C_0603]
C27  100nF_50V  [C_0603]
C28  100pF_50V  [C_0603]
C29  18pF_50V  [C_0603]
C30  18pF_50V  [C_0603]
C31  100nF_50V  [C_0603]
C32  220uF_6.3V  [C_1206]
C33  22uF_6.3V  [C_0603]
C34  1uF_50V  [C_0603]
C35  100nF_50V  [C_0603]
C36  33pF_50V  [C_0603]
C37  33pF_50V  [C_0603]
C38  33pF_50V  [C_0603]
C39  33pF_50V  [C_0603]
C40  220uF_6.3V  [C_1206]
C41  22uF_6.3V  [C_0603]
C42  1uF_50V  [C_0603]
C43  100nF_50V  [C_0603]
C44  33pF_50V  [C_0603]
C45  100nF_50V  [C_0603]
C46  100nF_50V  [C_0603]
C47  100nF_50V  [C_0603]
C48  22uF_6.3V  [C_0603]
CN8  uFL  [CN_RF_uFL]
CN9  uFL  [CN_RF_uFL]
CN10  uFL  [CN_RF_uFL]
CN11  MicroSIM  [CN_MicroSIM-Holder]
D7  TVS_15V  [D_0603]
D8  LED_Red  [LED_0603]
L1  47nH_300mA  [L_0603]
Q7  DDTC143  [Q_SOT23]
Q8  DDTC143  [Q_SOT23]
Q9  DDTC143  [Q_SOT23]
Q10  AOSP21313C  [U_8-SOIC_3.9]
Q11  DDTC143  [Q_SOT23]
Q12  DDTC143  [Q_SOT23]
Q13  PMV65XPEAR  [U_SOT23-3]
R41  10  [R_0603]
R42  0  [R_0603]
R43  0  [R_0603]
R44  0  [R_0603]
R45  0  [R_0603]
R46  0  [R_0603]
R47  0  [R_0603]
R48  0  [R_0603]
R49  22  [R_0603]
R50  22  [R_0603]
R51  0  [R_0603]
R52  22  [R_0603]
R53  15k  [R_0603]
R54  10k  [R_0603]
R55  68  [R_0603]
R56  0  [R_0603]
R57  0  [R_0603]
R58  10k  [R_0603]
R59  10k  [R_0603]
R60  1M  [R_0603]
R61  1M  [R_0603]
R62  10k  [R_0603]
R63  10k  [R_0603]
TP8  Test point  [TP_SMD_R1.0mm]  (value not drawn)  (no BOM)
TP9  Test point  [TP_SMD_R1.0mm]  (value not drawn)  (no BOM)
TP10  Test point  [TP_SMD_R1.0mm]  (value not drawn)  (no BOM)
TP11  Test point  [TP_SMD_R1.0mm]  (value not drawn)  (no BOM)
TP12  Test point  [TP_SMD_R1.0mm]  (value not drawn)  (no BOM)
TP13  Test point  [TP_SMD_R1.0mm]  (value not drawn)  (no BOM)
TP14  Test point  [TP_SMD_R1.0mm]  (value not drawn)  (no BOM)
U3  eSIM  [U_MFF2]
U4  SRV05-4HTG  [U_SOT23-6]
U5  BG95-M3  [U_BG96_BG95]
U6  NTB0104  [U_14-DHVQFN]
U7  NTB0104  [U_14-DHVQFN]

### Nets
GND: C26.1 C27.1 C29.1 C30.1 C31.1 C32.1 C33.1 C34.2 C35.1 C36.1 C37.1 C38.1 C39.1 C40.1 C41.1 C42.2 C43.1 C44.1 C45.2 C46.2 C47.1 C48.1 CN8.G CN9.G CN10.G CN11.0(GND) CN11.C5(GND) D7.1 Q7.2(E) Q8.2(E) Q9.2(E) Q11.2(E) Q12.2(E) R63.2 U3.C5(GND) U4.2(GND) U5.3(GND) U5.31(GND) U5.47(USIM_GND) U5.48(GND) U5.50(GND) U5.54(GND) U5.55(GND) U5.58(GND) U5.59(GND) U5.61(GND) U5.62(GND) U5.67(GND) U5.68(GND) U5.69(GND) U5.70(GND) U5.71(GND) U5.72(GND) U5.73(GND) U5.74(GND) U5.79(GND) U5.80(GND) U5.81(GND) U5.82(GND) U5.89(GND) U5.90(GND) U5.91(GND) U5.100(GND) U5.101(GND) U5.102(GND) U6.7(GND) U7.7(GND)
USIM_VDD: C26.2 C31.2 CN11.C1(VCC) R53.1 U3.C1(SIMVCC) U4.1(I/O_1) U5.43(USIM_VDD)
VDD: Q10.1(S) Q10.2(S) Q10.3(S) R60.2
VDD_EXT: C45.1 R54.1 U5.29(VDD_EXT) U6.1(VCCA) U7.1(VCCA)
VDD_MODEM: C27.2 C32.2 C33.2 C34.1 C35.2 C36.2 C40.2 C41.2 C42.1 C43.2 C44.2 C46.1 C48.2 D8.1(A) Q10.5(D) Q10.6(D) Q10.7(D) Q10.8(D) R41.1 R58.1 R59.1 R62.1 U5.32(VBAT_BB) U5.33(VBAT_BB) U5.52(VBAT_RF) U5.53(VBAT_RF) U6.14(VCCB) U7.14(VCCB)
CPU_CTS_MODEM: U7.12(B2)
CPU_DCD_MODEM: U6.11(B3)
CPU_DTR_MODEM: U6.10(B4)
CPU_RTS_MODEM: U7.13(B1)
CPU_RXD_GNSS: U7.11(B3)
CPU_RXD_MODEM: U6.12(B2)
CPU_TXD_GNSS: U7.10(B4)
CPU_TXD_MODEM: U6.13(B1)
CTS_BG95: U5.36(CTS) U7.2(A1)
DCD_BG95: U5.38(DCD) U6.4(A3)
DTR_BG95: U5.30(DTR) U6.5(A4)
MODEM_LVL_SHF_EN: U6.8(OE) U7.8(OE)
MODEM_PSM_IND: Q11.3(C) R62.2
MODEM_STATUS: Q8.3(C) R58.2
MODEM_VDD_PWR_CTRL: Q10.4(G) R60.1
NETLIGHT_BG95: Q7.1(B) U5.21(NETLIGHT)
nMODEM_PON_TRIG: Q13.1(G) R61.1
nMODEM_PWRKEY: Q9.1(B)
nMODEM_RESET: Q12.1(B)
nPWRKEY_BG95: C47.2 Q9.3(C) U5.15(PWRKEY)
nRESET_BG95: Q12.3(C) U5.17(RESET_N)
PON_TRIG_BG95: Q13.3(D) R63.1 U5.96(PON_TRIG)
PSM_IND_BG95: Q11.1(B) U5.1(PSM_IND)
RTS_BG95: U5.37(RTS) U7.3(A2)
RXD_BG95: U5.34(RXD) U6.2(A1)
RXD_GNSS_BG95: R57.1 U5.28(GNSS_RXD)
STATUS_BG95: Q8.1(B) U5.20(STATUS)
TXD_BG95: U5.35(TXD) U6.3(A2)
TXD_GNSS_BG95: R56.1 U5.27(GNSS_TXD)
NetC28_1: C28.1 C30.2 R45.2
NetC28_2: C28.2 CN10.S L1.2
NetC29_2: C29.2 R43.1 R45.1 U5.49(ANT_GNSS)
NetC37_2: C37.2 R46.2 R50.2 R51.1 R53.2 U4.3(I/O_2)
NetC38_2: C38.2 R44.2 R48.1 R49.2 U4.6(I/O_4)
NetC39_2: C39.2 R42.2 R47.1 R52.2 U4.4(I/O_3)
NetCN8_S: CN8.S R43.2
NetCN9_S: CN9.S U5.60(ANT_MAIN)
NetCN11_C2: CN11.C2(RST) R47.2
NetCN11_C3: CN11.C3(CLK) R48.2
NetCN11_C7: CN11.C7(I/O) R51.2
NetD7_2: D7.2 TP9.1 U5.75(USB_BOOT)
NetD8_2: D8.2(K) R55.2
NetL1_1: L1.1 R41.2
NetQ7_3: Q7.3(C) R55.1
NetQ13_2: Q13.2(S) R59.2 R61.2
NetR42_1: R42.1 U3.C2(SIMRST)
NetR44_1: R44.1 U3.C3(SIMCLK)
NetR46_1: R46.1 U3.C7(SIMDATA)
NetR49_1: R49.1 U5.46(USIM_CLK)
NetR50_1: R50.1 U5.45(USIM_DATA)
NetR52_1: R52.1 U5.44(USIM_RST)
NetR54_2: R54.2 TP8.1
NetR56_2: R56.2 U7.4(A3)
NetR57_2: R57.2 U7.5(A4)
NetTP10_1: TP10.1 U5.8(USB_VBUS)
NetTP11_1: TP11.1 U5.9(USB_DP)
NetTP12_1: TP12.1 U5.10(USB_DM)
NetTP13_1: TP13.1 U5.22(DBG_RXD)
NetTP14_1: TP14.1 U5.23(DBG_TXD)

Not connected (* = marked no-connect by the designer): CN11 C6(VPP)* X1 X2; U3 C4(PIN5)* C6(PIN2)* C8(PIN4)* NC; U4 5(VCC)*; U5 2(ADC1)* 4(PCM_CLK)* 5(PCM_SYNC)* 6(PCM_IN)* 7(PCM_OUT)* 11(RESERVED) 12(RESERVED) 13(RESERVED) 14(RESERVED) 16(RESERVED) 18(W_DISABLE#)* 19(AP_READY)* 24(ADC0)* 25(GPIO1)* 26(GPIO2)* 39(RI)* 40(I2C_SCL)* 41(I2C_SDA)* 42(USIM_PRESENCE)* 51(RESERVED) 56(RESERVED) 57(RESERVED) 63(RESERVED) 64(GPIO3)* 65(GPIO4)* 66(GPIO5)* 76(RESERVED) 77(RESERVED) 78(RESERVED) 83(GRFC1)* 84(GRFC2)* 85(GPIO6)* 86(GPIO7)* 87(GPIO8)* 88(GPIO9)* 92(RESERVED) 93(RESERVED) 94(RESERVED) 95(RESERVED) 97(RESERVED) 98(RESERVED) 99(RESERVED); U6 6(NC)* 9(NC)*; U7 6(NC)* 9(NC)*

### Notes on the sheet
- MODEM BG95
- (near C32) 3.3V - 4.3V
- (near C40) 3.3V - 4.3V
- Size:
- Date:
- A3
- Revision:
- Modified:
- Project:
- Sheet:
- of
- Swiss Innovation Lab AG
- Bernstrasse 18
- 2555 Brügg
- Switzerland
- SIL
- +
- File:

### Library data of the parts
C26 C27 C31 C35 C43 C45-C47 = C_100nF_50V: as C1 on sheet S3220B1; Price: 0,01309; Supplier 1: Digi-Key; Supplier Part Number 1: 445-1314-6-ND
C28 = C_33pF_50V: 33pF ±1% 50V Ceramic Capacitor C0G, NP0 0603 (1608 Metric); Manufacturer: Samsung Electro-Mechanics; Manufacturer Part Number: CL10C101FB8NNNC; Value: 100pF; ValueAux: _50V; Currency: $; Price: 0,04166; Supplier 1: Digi-Key; Supplier Part Number 1: 1276-2159-2-ND
C29 C30 = C_18pF_50V: as C8 on sheet S3220B2; Value: 18pF; Price: 0,00974; Supplier 1: Digi-Key; Supplier Part Number 1: 399-1052-1-ND
C32 C40 = C_220uF_6.3V: as C5 on sheet S3220B1; Price: 0,59945; Supplier 1: Digi-Key; Supplier Part Number 1: 490-13970-1-ND
C33 C41 C48 = C_22uF_6V3: as C25 on sheet S3220B2; Price: 0,04566; Supplier 1: Digi-Key; Supplier Part Number 1: 1276-1193-1-ND
C34 C42 = C_1uF_50V: 1µF 50V Ceramic Capacitor X5R 0603 (1608 Metric) 0.063" L x 0.032" W (1.60mm x 0.80mm); Manufacturer: Samsung Electro-Mechanics; Manufacturer Part Number: CL10A105KB8NNNC; Value: 1uF; ValueAux: _50V; Currency: $; Price: 0,03472; Supplier 1: Digi-Key; Supplier Part Number 1: 1276-1860-1-ND
C36-C39 C44 = C_33pF_50V: 33pF ±1% 50V Ceramic Capacitor C0G, NP0 0603 (1608 Metric); Manufacturer: Samsung Electro-Mechanics; Manufacturer Part Number: CL10C330FB8NNNC; ValueAux: _50V; Currency: $; Value: 33pF; Price: 0,04166; Supplier 1: Digi-Key; Supplier Part Number 1: 1276-2262-6-ND
CN8-CN10 = CN_RF_uFL: Ultra Miniature Coaxial Connector Jack, Male Pin 50 Ohm Surface Mount Solder; Manufacturer: TE Connectivity AMP Connectors; Manufacturer Part Number: 1909763-1; Currency: $; Value: uFL; Price: 0,25410; Supplier 1: Digi-Key; Supplier Part Number 1: A118077CT-ND
CN11 = CN_MicroSIM-Holder: 6 Position Card Connector Micro SIM Surface Mount, Right Angle Gold; Manufacturer: Molex LLC; Manufacturer Part Number: 0788000001; Currency: $; Value: MicroSIM; Price: 1,14178; Supplier 1: Digi-Key; Supplier Part Number 1: WM9786CT-ND
D7 = D_TVS_15V: TVS DIODE 15V 27.4V DSN1608-2; Manufacturer: Nexperia USA Inc.; Manufacturer Part Number: PTVS15VZ1USKYL; ValueAux: _15V; Currency: $; Value: TVS; Price: 0,09950; Supplier 1: Digi-Key; Supplier Part Number 1: 1727-2745-6-ND
D8 = D_LED_R_5mA: as D6 on sheet S3220B2; Value: LED; Price: 0,07565; Supplier 1: Digi-Key; Supplier Part Number 1: 160-1830-1-ND
L1 = L_47nH_300mA: 47nH Unshielded Multilayer Inductor 300mA 700 mOhm Max 0603 (1608 Metric); Manufacturer: Taiyo Yuden; Manufacturer Part Number: HK160847NJ-T; ValueAux: _300mA; Currency: $; Value: 47nH; Price: 0,03961; Supplier 1: Digi-Key; Supplier Part Number 1: 587-1553-1-ND
Q7-Q9 Q11 Q12 = Q_DDTC143: Pre-Biased Bipolar Transistor (BJT) NPN - Pre-Biased 50 V 100 mA 250 MHz 200 mW Surface Mount SOT-23-3; Manufacturer: Diodes Incorporated; Manufacturer Part Number: DDTC143ZCA-7-F; Currency: $; Value: DDTC143; Price: 0,04198; Supplier 1: Digi-Key; Supplier Part Number 1: DDTC143ZCA-FDICT-ND
Q10 = Q_AOSP21313C: P-Channel 30 V 7A (Ta) 2.5W (Ta) Surface Mount 8-SOIC; Manufacturer: Alpha & Omega Semi.; Currency: $; Value: AOSP21313C; Manufacturer Part Number: AOSP21313C; Price: 0,28336; Supplier 1: Digi-Key; Supplier Part Number 1: 785-AOSP21313CCT-ND
Q13 = Q_PMV65: as Q1 on sheet S3220B1; Value: PMV65XPEAR; Manufacturer Part Number: PMV65XPEAR; Price: 0,11204; Supplier 1: Digi-Key; Supplier Part Number 1: 1727-2310-1-ND
R41 = R_10_1%: 10 Ohms ±1% 0.1W, 1/10W Chip Resistor 0603 (1608 Metric) Automotive AEC-Q200 Thick Film; Manufacturer: Panasonic Electronic Components; Manufacturer Part Number: ERJ-3EKF10R0V; Currency: $; Value: 10; Price: 0,01153; Supplier 1: Digi-Key; Supplier Part Number 1: P10.0HCT-ND
R42-R48 R51 R56 R57 = R_0_1%: as R26 on sheet S3220B2; Value: 0; Price: 0,00962; Supplier 1: Digi-Key; Supplier Part Number 1: P0.0GCT-ND
R49 R50 R52 = R_22_1%: 22 Ohms ±1% 0.1W, 1/10W Chip Resistor 0603 (1608 Metric) Automotive AEC-Q200 Thick Film; Manufacturer: Panasonic Electronic Components; Manufacturer Part Number: ERJ-3EKF22R0V; Currency: $; Value: 22; Price: 0,01153; Supplier 1: Digi-Key; Supplier Part Number 1: P22.0HCT-ND
R53 = R_15k_1%: 15 kOhms ±1% 0.1W, 1/10W Chip Resistor 0603 (1608 Metric) Automotive AEC-Q200, Moisture Resistant Thick Film; Manufacturer: Yageo; Manufacturer Part Number: AC0603FR-0715KL; Currency: $; Value: 15k; Price: 0,00527; Supplier 1: Digi-Key; Supplier Part Number 1: YAG3569DKR-ND
R54 R58 R59 R62 R63 = R_10k_1%: as R15 on sheet S3220B1; Value: 10k; Price: 0,01449; Supplier 1: Digi-Key; Supplier Part Number 1: P10.0KHCT-ND
R55 = R_68_1%: as R3 on sheet S3220B1; Value: 68; Price: 0,01449; Supplier 1: Digi-Key; Supplier Part Number 1: P68.0HCT-ND
R60 R61 = R_1M_1%: as R1 on sheet S3220B1; Value: 1M; Price: 0,01264; Supplier 1: Digi-Key; Supplier Part Number 1: P1.00MHCT-ND
TP8-TP14 = TP_Test_point: as TP1 on sheet S3220B1; Value: Test point; Manufacturer Part Number: Test point; Price: 0
U3 = U_eSIM-M2M: M2M embedded SIM card IC; Manufacturer: 1NCE; Currency: $; Value: eSIM; Manufacturer Part Number: eSIM; Price: 12,0; Supplier 1: 1NCE; Supplier Part Number 1: eSIM
U4 = U_SRV05-4HTG: TVS DIODE 6V 15V SOT23-6; Manufacturer: Littelfuse Inc.; Currency: $; Value: SRV05-4HTG; Manufacturer Part Number: SRV05-4HTG; Price: 0,40556; Supplier 1: Digi-Key; Supplier Part Number 1: F4204CT-ND
U5 = U_BG95: MultiBand, 3GPP Rel.13, LTE Cat.M1/NB1, GSM/EGPRS, 3xUART, VoLTE; Manufacturer: Quectel; Currency: $; Value: BG95-M3; Manufacturer Part Number: BG95-M3; Price: 15,98590; Supplier 1: Codico; Supplier Part Number 1: BG95-M3
U6 U7 = U_NTB0104BQ: Voltage Level Translator Bidirectional 1 Circuit 4 Channel 100Mbps 14-DHVQFN (2.5x3); Manufacturer: NXP USA Inc.; Manufacturer Part Number: NTB0104BQ,115; Currency: $; Value: NTB0104; Price: 0,57635; Supplier 1: Digi-Key; Supplier Part Number 1: 568-8404-1-ND

## Sheet S3220B4.SchDoc: BLE and peripheras
size A3; Revision: B; SheetNumber: 4; SheetTotal: 5
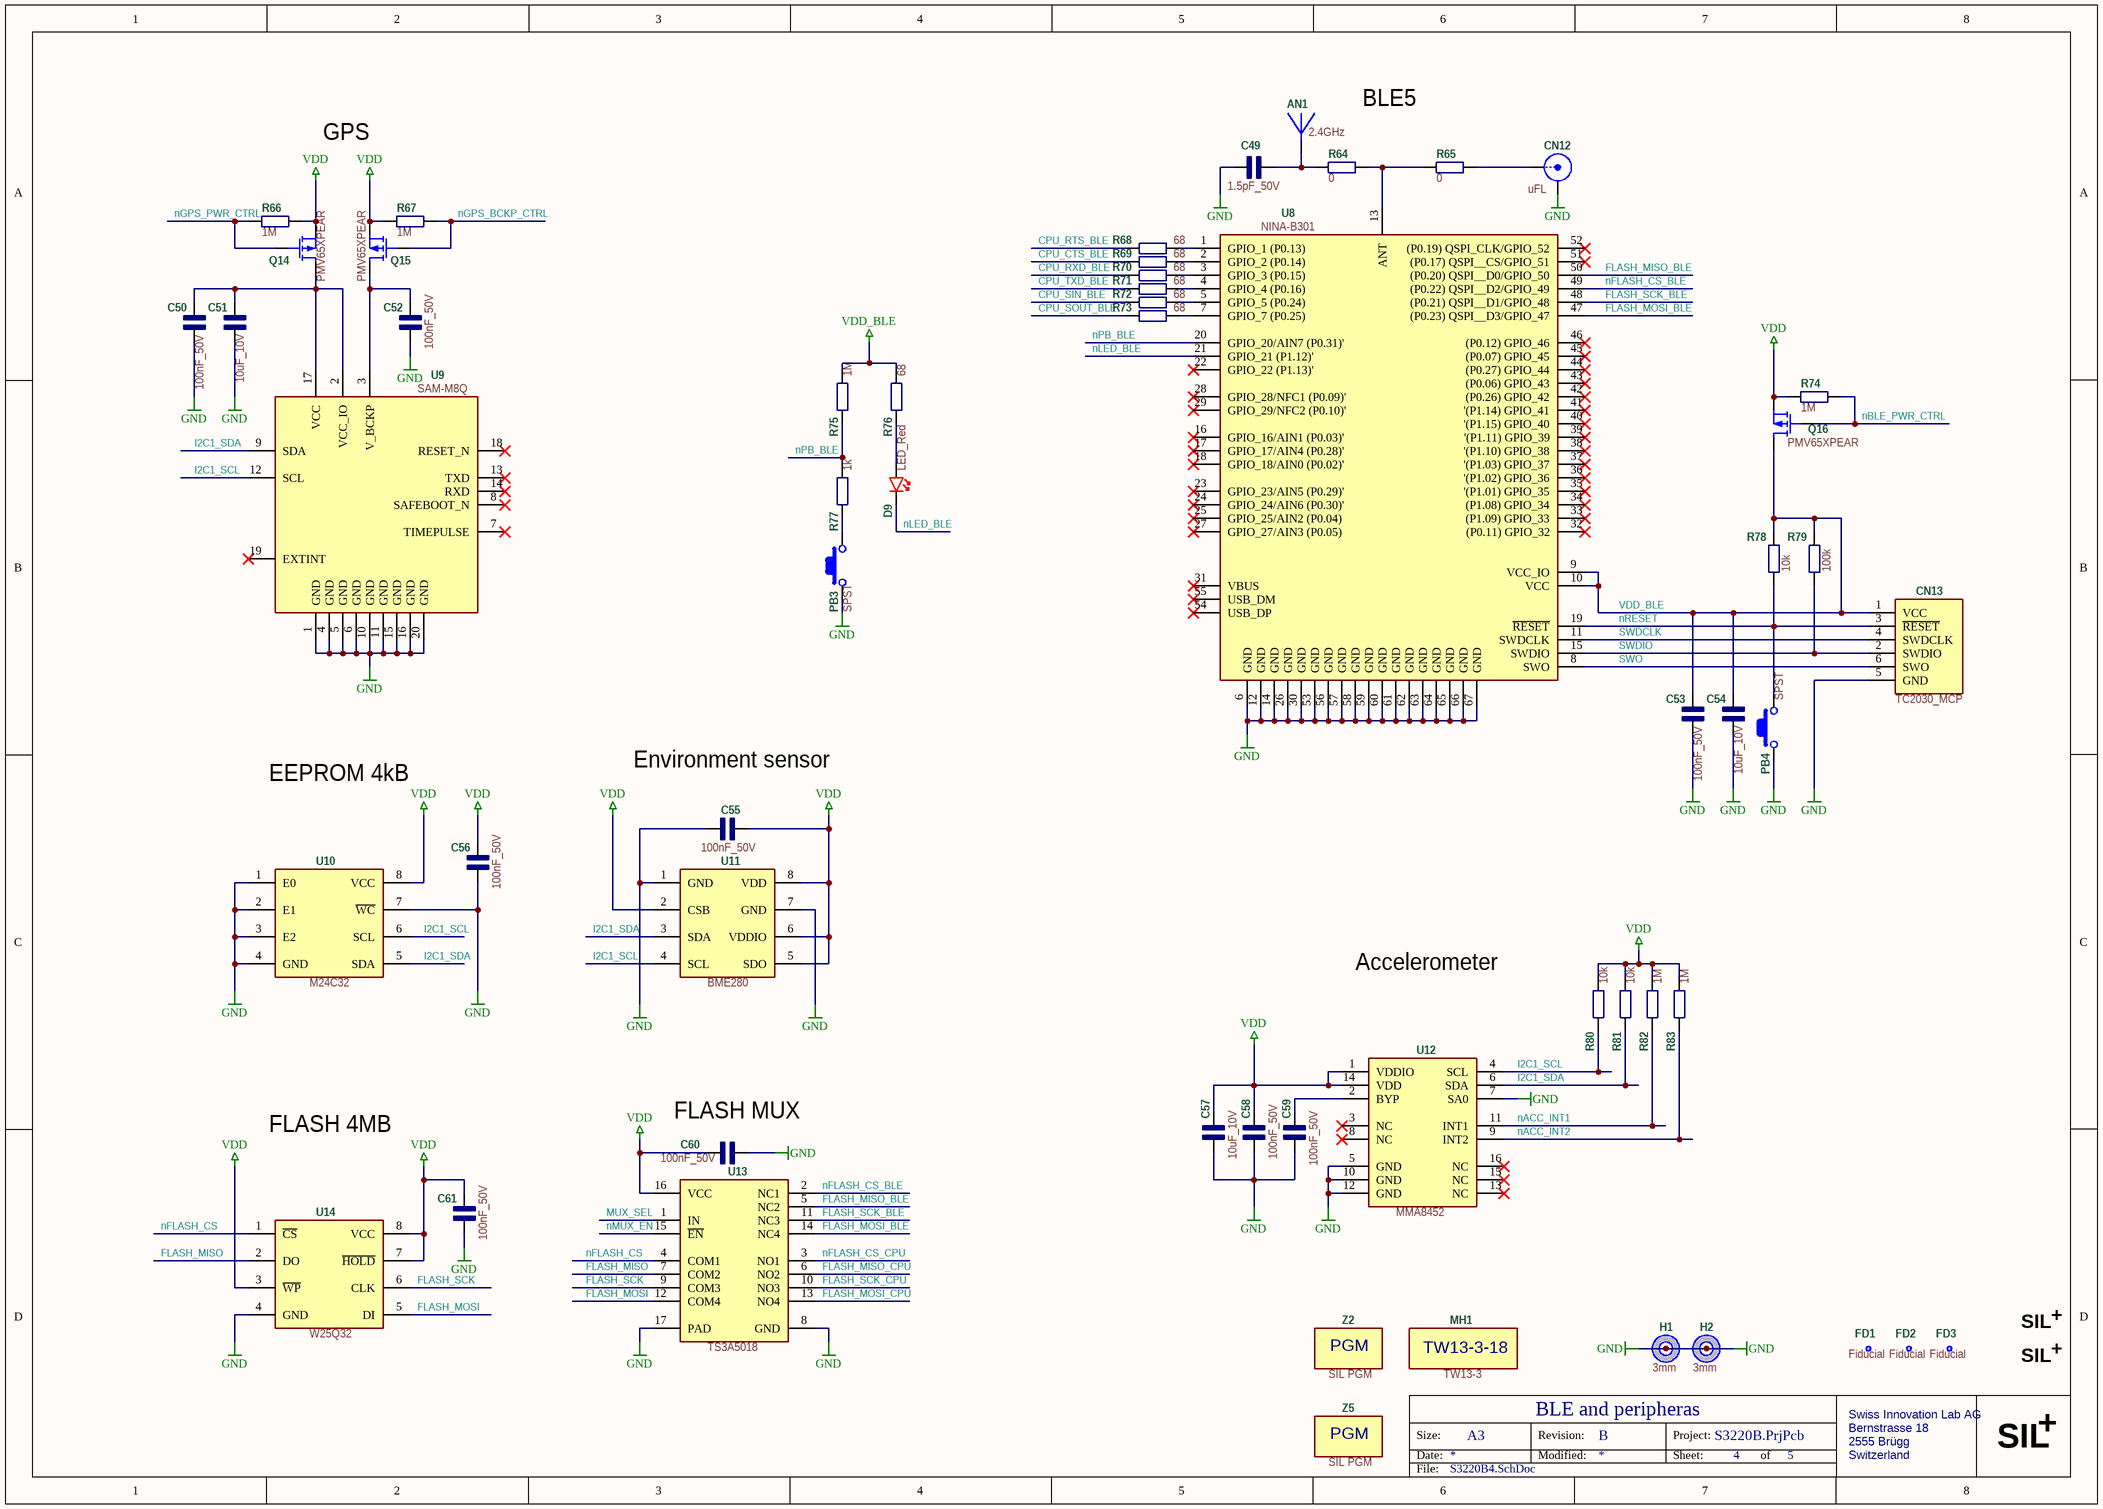
[diagram p3: S3220B4.SchDoc]

### Parts
AN1  2.4GHz  [AN_2400-PCB-B]  (no BOM)
C49  1.5pF_50V  [C_0603]
C50  100nF_50V  [C_0603]
C51  10uF_10V  [C_0603]
C52  100nF_50V  [C_0603]
C53  100nF_50V  [C_0603]
C54  10uF_10V  [C_0603]
C55  100nF_50V  [C_0603]
C56  100nF_50V  [C_0603]
C57  10uF_10V  [C_0603]
C58  100nF_50V  [C_0603]
C59  100nF_50V  [C_0603]
C60  100nF_50V  [C_0603]
C61  100nF_50V  [C_0603]
CN12  uFL  [CN_RF_uFL]
CN13  TC2030_MCP  [CN_TC2030-MCP-NL]  (no BOM)
D9  LED_Red  [LED_0603]
FD1  Fiducial  [FD_Fiducial]  (no BOM)
FD2  Fiducial  [FD_Fiducial]  (no BOM)
FD3  Fiducial  [FD_Fiducial]  (no BOM)
H1  3mm  [H_Hole_30M_55M]  (no BOM)
H2  3mm  [H_Hole_30M_55M]  (no BOM)
MH1  TW13-3  [MH_TW13-3]  (no BOM)
PB3  SPST  [PB_PTS810]
PB4  SPST  [PB_PTS810]
Q14  PMV65XPEAR  [U_SOT23-3]
Q15  PMV65XPEAR  [U_SOT23-3]
Q16  PMV65XPEAR  [U_SOT23-3]
R64  0  [R_0603]
R65  0  [R_0603]
R66  1M  [R_0603]
R67  1M  [R_0603]
R68  68  [R_0603]
R69  68  [R_0603]
R70  68  [R_0603]
R71  68  [R_0603]
R72  68  [R_0603]
R73  68  [R_0603]
R74  1M  [R_0603]
R75  1M  [R_0603]
R76  68  [R_0603]
R77  1k  [R_0603]
R78  10k  [R_0603]
R79  100k  [R_0603]
R80  10k  [R_0603]
R81  10k  [R_0603]
R82  1M  [R_0603]
R83  1M  [R_0603]
U8  NINA-B301  [U_NINA-B301]
U9  SAM-M8Q  [U_SAM-M8Q]
U10  M24C32  [U_8-SOIC_3.9]
U11  BME280  [U_BME280]
U12  MMA8452  [U_16-QFN-5X3]
U13  TS3A5018  [U_16-VFQFN]
U14  W25Q32  [U_8-SOIC_5.3]
Z2  SIL PGM  [Z_SIL-PGM]  (no BOM)
Z3  SIL logo  [Z_SIL-logo]  (value not drawn)  (no BOM)
Z4  SIL logo  [Z_SIL-logo]  (value not drawn)  (no BOM)
Z5  SIL PGM  [Z_SIL-PGM]  (no BOM)

### Nets
GND: C49.1 C50.1 C51.1 C52.1 C53.1 C54.1 C55.2 C56.1 C57.1 C58.2 C59.2 C60.2 C61.1 CN12.G CN13.5(GND) H1.0 H2.0 PB3.2 PB4.1 U8.6(GND) U8.12(GND) U8.14(GND) U8.26(GND) U8.30(GND) U8.53(GND) U8.56(GND) U8.57(GND) U8.58(GND) U8.59(GND) U8.60(GND) U8.61(GND) U8.62(GND) U8.63(GND) U8.64(GND) U8.65(GND) U8.66(GND) U8.67(GND) U9.1(GND) U9.4(GND) U9.5(GND) U9.6(GND) U9.10(GND) U9.11(GND) U9.15(GND) U9.16(GND) U9.20(GND) U10.1(E0) U10.2(E1) U10.3(E2) U10.4(GND) U10.7(~{WC}) U11.1(GND) U11.7(GND) U12.5(GND) U12.7(SA0) U12.10(GND) U12.12(GND) U13.8(GND) U13.17(PAD) U14.4(GND)
VDD: C55.1 C56.2 C57.2 C58.1 C60.1 C61.2 Q14.2(S) Q15.2(S) Q16.2(S) R66.2 R67.2 R74.2 R80.2 R81.2 R82.1 R83.1 U10.8(VCC) U11.2(CSB) U11.5(SDO) U11.6(VDDIO) U11.8(VDD) U12.1(VDDIO) U12.14(VDD) U13.16(VCC) U14.3(~{WP}) U14.7(~{HOLD}) U14.8(VCC)
VDD_BLE: C53.2 C54.2 CN13.1(VCC) Q16.3(D) R75.1 R76.2 R78.2 R79.2 U8.9(VCC_IO) U8.10(VCC)
CPU_CTS_BLE: R69.1
CPU_RTS_BLE: R68.1
CPU_RXD_BLE: R70.1
CPU_SIN_BLE: R72.1
CPU_SOUT_BLE: R73.1
CPU_TXD_BLE: R71.1
FLASH_MISO: U13.7(COM2) U14.2(DO)
FLASH_MISO_BLE: U8.50((P0.20)_QSPI__D0/GPIO_50) U13.5(NC2)
FLASH_MISO_CPU: U13.6(NO2)
FLASH_MOSI: U13.12(COM4) U14.5(DI)
FLASH_MOSI_BLE: U8.47((P0.23)_QSPI__D3/GPIO_47) U13.14(NC4)
FLASH_MOSI_CPU: U13.13(NO4)
FLASH_SCK: U13.9(COM3) U14.6(CLK)
FLASH_SCK_BLE: U8.48((P0.21)_QSPI__D1/GPIO_48) U13.11(NC3)
FLASH_SCK_CPU: U13.10(NO3)
I2C1_SCL: R80.1 U9.12(SCL) U10.6(SCL) U11.4(SCL) U12.4(SCL)
I2C1_SDA: R81.1 U9.9(SDA) U10.5(SDA) U11.3(SDA) U12.6(SDA)
MUX_SEL: U13.1(IN)
nACC_INT1: R82.2 U12.11(INT1)
nACC_INT2: R83.2 U12.9(INT2)
nBLE_PWR_CTRL: Q16.1(G) R74.1
nFLASH_CS: U13.4(COM1) U14.1(~{CS})
nFLASH_CS_BLE: U8.49((P0.22)_QSPI__D2/GPIO_49) U13.2(NC1)
nFLASH_CS_CPU: U13.3(NO1)
nGPS_BCKP_CTRL: Q15.1(G) R67.1
nGPS_PWR_CTRL: Q14.1(G) R66.1
nLED_BLE: D9.2(K) U8.21(GPIO_21_(P1.12)')
nMUX_EN: U13.15(~{EN})
nPB_BLE: R75.2 R77.2 U8.20(GPIO_20/AIN7_(P0.31)')
nRESET: CN13.3(~{RESET}) PB4.2 R78.1 U8.19(~{RESET})
SWDCLK: CN13.4(SWDCLK) U8.11(SWDCLK)
SWDIO: CN13.2(SWDIO) R79.1 U8.15(SWDIO)
SWO: CN13.6(SWO) U8.8(SWO)
NetAN1_1: AN1.1 C49.2 R64.1
NetC50_2: C50.2 C51.2 Q14.3(D) U9.2(VCC_IO) U9.17(VCC)
NetC52_2: C52.2 Q15.3(D) U9.3(V_BCKP)
NetC59_1: C59.1 U12.2(BYP)
NetCN12_S: CN12.S R65.2
NetD9_1: D9.1(A) R76.1
NetPB3_1: PB3.1 R77.1
NetR64_2: R64.2 R65.1 U8.13(ANT)
NetR68_2: R68.2 U8.1(GPIO_1_(P0.13))
NetR69_2: R69.2 U8.2(GPIO_2_(P0.14))
NetR70_2: R70.2 U8.3(GPIO_3_(P0.15))
NetR71_2: R71.2 U8.4(GPIO_4_(P0.16))
NetR72_2: R72.2 U8.5(GPIO_5_(P0.24))
NetR73_2: R73.2 U8.7(GPIO_7_(P0.25))

Not connected (* = marked no-connect by the designer): FD1 0; FD2 0; FD3 0; MH1 0; U8 16(GPIO_16/AIN1_(P0.03)')* 17(GPIO_17/AIN4_(P0.28)')* 18(GPIO_18/AIN0_(P0.02)')* 22(GPIO_22_(P1.13)')* 23(GPIO_23/AIN5_(P0.29)')* 24(GPIO_24/AIN6_(P0.30)')* 25(GPIO_25/AIN2_(P0.04))* 27(GPIO_27/AIN3_(P0.05))* 28(GPIO_28/NFC1_(P0.09)')* 29(GPIO_29/NFC2_(P0.10)')* 31(VBUS)* 32((P0.11)_GPIO_32)* 33((P1.09)_GPIO_33)* 34((P1.08)_GPIO_34)* 35('(P1.01)_GPIO_35)* 36('(P1.02)_GPIO_36)* 37('(P1.03)_GPIO_37)* 38('(P1.10)_GPIO_38)* 39('(P1.11)_GPIO_39)* 40('(P1.15)_GPIO_40)* 41('(P1.14)_GPIO_41)* 42((P0.26)_GPIO_42)* 43((P0.06)_GPIO_43)* 44((P0.27)_GPIO_44)* 45((P0.07)_GPIO_45)* 46((P0.12)_GPIO_46)* 51((P0.17)_QSPI__CS/GPIO_51)* 52((P0.19)_QSPI_CLK/GPIO_52)* 54(USB_DP)* 55(USB_DM)*; U9 7(TIMEPULSE)* 8(SAFEBOOT_N)* 13(TXD)* 14(RXD)* 18(RESET_N)* 19(EXTINT)*; U12 3(NC)* 8(NC)* 13(NC)* 15(NC)* 16(NC)*; Z2 0; Z3 0; Z4 0; Z5 0

### Notes on the sheet
- BLE5
- GPS
- EEPROM 4kB
- Environment sensor
- Accelerometer
- (near C60) FLASH MUX
- FLASH 4MB
- Size:
- Date:
- A3
- Revision:
- Modified:
- Project:
- Sheet:
- of
- Swiss Innovation Lab AG
- Bernstrasse 18
- 2555 Brügg
- Switzerland
- SIL
- +
- File:
- (in symbol MH_TW13-3) TW13-3-18
- (in symbol Z_PGM) PGM
- (in symbol Z_SIL_logo) +; SIL

### Library data of the parts
AN1 = AN_2.4GHz-PCB: 2.4 GHz PCB antenna; Manufacturer: Swiss Innovation Lab; Manufacturer Part Number: SIL AN24GHZ; Currency: $; Value: 2.4GHz; Price: 0; Supplier 1: SIL; Supplier Part Number 1: SIL AN24GHZ
C49 = C_1.5pF_50V: 1.5pF ±0.1pF 50V Ceramic Capacitor C0G, NP0 0603 (1608 Metric); Manufacturer: Samsung Electro-Mechanics; Manufacturer Part Number: CL10C1R5BB8NNNC; ValueAux: _50V; Currency: $; Value: 1.5pF; Price: 0,01291; Supplier 1: Digi-Key; Supplier Part Number 1: 1276-1071-1-ND
C50 C52 C53 C55 C56 C58-C61 = C_100nF_50V: as C1 on sheet S3220B1; Price: 0,01309; Supplier 1: Digi-Key; Supplier Part Number 1: 445-1314-6-ND
C51 C54 C57 = C_10uF_10V: as C2 on sheet S3220B1; Price: 0,03994; Supplier 1: Digi-Key; Supplier Part Number 1: 490-10474-1-ND
CN12 = CN_RF_uFL: as CN8 on sheet S3220B3; Value: uFL; Price: 0,25410; Supplier 1: Digi-Key; Supplier Part Number 1: A118077CT-ND
CN13 = CN_TC2030: as CN7 on sheet S3220B2; Price: 0
D9 = D_LED_R_5mA: as D6 on sheet S3220B2; Value: LED; Price: 0,07565; Supplier 1: Digi-Key; Supplier Part Number 1: 160-1830-1-ND
FD1-FD3 = FD_Fiducial: Reference point for assembly machine; Manufacturer: Swiss Innovation Lab; Currency: $; Value: Fiducial; Manufacturer Part Number: Fiducial; Price: 0; Supplier 1: Swiss Innovation Lab; Supplier Part Number 1: Fiducial
H1 H2 = H_Hole_3M_55M: Hole 3mm, Pad 5.5mm; Manufacturer: Swiss Innovation Lab; Currency: $; Value: 3mm; Manufacturer Part Number: Hole 3mm; Price: 0; Supplier 1: Swiss Innovation Lab; Supplier Part Number 1: Hole 3mm
MH1 = MH_TW13-3: Case Takachi TW13-3; Currency: $; Value: TW13-3; Manufacturer: Takachi; Manufacturer Part Number: TW13-3; Price: 0
PB3 PB4 = PB_SPST_2.5mm: as PB1 on sheet S3220B2; Value: SPST; Price: 0,17302; Supplier 1: Digi-Key; Supplier Part Number 1: CKN10502DKR-ND
Q14-Q16 = Q_PMV65: as Q1 on sheet S3220B1; Value: PMV65XPEAR; Manufacturer Part Number: PMV65XPEAR; Price: 0,11204; Supplier 1: Digi-Key; Supplier Part Number 1: 1727-2310-1-ND
R64 R65 = R_0_1%: as R26 on sheet S3220B2; Value: 0; Price: 0,00962; Supplier 1: Digi-Key; Supplier Part Number 1: P0.0GCT-ND
R66 R67 R74 R75 R82 R83 = R_1M_1%: as R1 on sheet S3220B1; Value: 1M; Price: 0,01264; Supplier 1: Digi-Key; Supplier Part Number 1: P1.00MHCT-ND
R68-R73 R76 = R_68_1%: as R3 on sheet S3220B1; Value: 68; Price: 0,01449; Supplier 1: Digi-Key; Supplier Part Number 1: P68.0HCT-ND
R77 = R_1k_1%: as R32 on sheet S3220B2; Value: 1k; Price: 0,01153; Supplier 1: Digi-Key; Supplier Part Number 1: P1.00KHCT-ND
R78 R80 R81 = R_10k_1%: as R15 on sheet S3220B1; Value: 10k; Price: 0,01449; Supplier 1: Digi-Key; Supplier Part Number 1: P10.0KHCT-ND
R79 = R_100k_1%: 100 kOhms ±1% 0.1W, 1/10W Chip Resistor 0603 (1608 Metric) Automotive AEC-Q200 Thick Film; Manufacturer: Panasonic Electronic Components; Manufacturer Part Number: ERJ-3EKF1003V; Currency: $; Value: 100k; Price: 0,01367; Supplier 1: Digi-Key; Supplier Part Number 1: P100KHCT-ND
U8 = U_NINA-B301: MOD BLE 4.2 NORDIC NRF52840 SOC; Manufacturer: uBlox; Currency: $; Value: NINA-B301; Manufacturer Part Number: NINA-B301; Price: 7,5; Supplier 1: uBlox; Supplier Part Number 1: NINA-B301
U9 = U_SAM-M8Q: SAM-M8Q RF Receiver Galileo, GLONASS, GPS 1.575GHz, 1.602GHz -165dBm 400kbps; Manufacturer: U-Blox America Inc.; Manufacturer Part Number: SAM-M8Q-0-10; Currency: $; Value: SAM-M8Q; Price: 12,75120; Supplier 1: Digi-Key; Supplier Part Number 1: 672-1054-1-ND
U10 = U_M24C32: EEPROM Memory IC 32Kb (4K x 8) I2C 1MHz 450ns 8-SO; Manufacturer: STMicroelectronics; Manufacturer Part Number: M24C32-WMN6TP; Currency: $; Value: M24C32; Price: 0,18324; Supplier 1: Digi-Key; Supplier Part Number 1: 497-5027-1-ND
U11 = U_BME280: Humidity Temperature Sensor 0 ~ 100% RH I2C, SPI ±3% 1s Surface Mount; Manufacturer: Bosch Sensortec; Currency: $; Value: BME280; Manufacturer Part Number: BME280; Price: 3,71140; Supplier 1: Digi-Key; Supplier Part Number 1: 828-1063-1-ND
U12 = U_MMA8452: Accelerometer X, Y, Z Axis ±2g, 4g, 8g 0.78Hz ~ 400Hz 16-QFN (3x3); Manufacturer: NXP USA Inc.; Manufacturer Part Number: MMA8452QT; Currency: $; Value: MMA8452; Price: 1,09888; Supplier 1: Digi-Key; Supplier Part Number 1: MMA8452QT-ND
U13 = U_TS3A5018: 4 Circuit IC Switch 2:1 10Ohm 16-UQFN (2.6x1.8); Manufacturer: Texas Instruments; Manufacturer Part Number: TS3A5018RGYR; Currency: $; Value: TS3A5018; Price: 0,25928; Supplier 1: Digi-Key; Supplier Part Number 1: 296-19899-1-ND
U14 = U_W25Q32: FLASH - NOR Memory IC 32Mb (4M x 8) SPI - Quad I/O 133MHz  8-SOIC; Manufacturer: Winbond Electronics; Manufacturer Part Number: W25Q32JVSSIQ; Currency: $; Value: W25Q32; Price: 0,97; Supplier 1: Digi-Key; Supplier Part Number 1: W25Q32JVSSIQ-ND
Z2 Z5 = Z_PGM: Programmer Template; Manufacturer: Swiss Innovation Lab; Currency: $; Value: SIL PGM; Manufacturer Part Number: SIL PGM; Price: 0
Z3 Z4 = Z_SIL_logo: Manufacturer: Swiss Innovation Lab; Currency: $; Value: SIL logo; Manufacturer Part Number: SIL Logo; Price: 0; Supplier 1: Swiss Innovation Lab; Supplier Part Number 1: SIL Logo

## Nets that join several sheets
GND: S3220B1 (28 pins), S3220B2 (31 pins), S3220B3 (67 pins), S3220B4 (60 pins)
VBUS_C: S3220B1 (6 pins), S3220B2 (R29.1)
VDD: S3220B1 (14 pins), S3220B2 (29 pins), S3220B3 (Q10.1 Q10.2 Q10.3 R60.2), S3220B4 (27 pins)
BATTERY_AIN: S3220B1 (R2.1 R6.2 TP3.1), S3220B2 (U2.35)
CPU_BUSY_RFID: S3220B1 (CN6.8), S3220B2 (U2.40)
CPU_CTS_BLE: S3220B2 (U2.23), S3220B4 (R69.1)
CPU_CTS_MODEM: S3220B2 (U2.58), S3220B3 (U7.12)
CPU_DCD_MODEM: S3220B2 (U2.61), S3220B3 (U6.11)
CPU_DTR_MODEM: S3220B2 (U2.60), S3220B3 (U6.10)
CPU_MISO_RFID: S3220B1 (CN6.6), S3220B2 (M1.13 U2.84)
CPU_MISO_SD: S3220B1 (R19.1), S3220B2 (U2.79)
CPU_MOSI_RFID: S3220B1 (CN6.5), S3220B2 (M1.14 U2.85)
CPU_MOSI_SD: S3220B1 (R18.1), S3220B2 (U2.80)
CPU_RTS_BLE: S3220B2 (U2.24), S3220B4 (R68.1)
CPU_RTS_MODEM: S3220B2 (U2.59), S3220B3 (U7.13)
CPU_RXD_BLE: S3220B2 (U2.26), S3220B4 (R70.1)
CPU_RXD_GNSS: S3220B2 (U2.15), S3220B3 (U7.11)
CPU_RXD_MODEM: S3220B2 (U2.56), S3220B3 (U6.12)
CPU_SCK_RFID: S3220B1 (CN6.7), S3220B2 (M1.12 U2.82)
CPU_SCK_SD: S3220B1 (R17.1), S3220B2 (U2.78)
CPU_SIN_BLE: S3220B2 (U2.90), S3220B4 (R72.1)
CPU_SOUT_BLE: S3220B2 (U2.37), S3220B4 (R73.1)
CPU_TXD_BLE: S3220B2 (U2.25), S3220B4 (R71.1)
CPU_TXD_GNSS: S3220B2 (U2.16), S3220B3 (U7.10)
CPU_TXD_MODEM: S3220B2 (U2.55), S3220B3 (U6.13)
FLASH_MISO_CPU: S3220B2 (U2.31), S3220B4 (U13.6)
FLASH_MOSI_CPU: S3220B2 (U2.32), S3220B4 (U13.13)
FLASH_SCK_CPU: S3220B2 (U2.30), S3220B4 (U13.10)
I2C1_SCL: S3220B2 (U2.95), S3220B4 (5 pins)
I2C1_SDA: S3220B2 (U2.96), S3220B4 (5 pins)
I2C2_SCL: S3220B1 (CN5.4 R16.1), S3220B2 (M1.4 U2.47)
I2C2_SDA: S3220B1 (CN5.3 R15.1), S3220B2 (M1.3 U2.48)
LED_1: S3220B1 (D5.1), S3220B2 (U2.52)
LED_2: S3220B1 (D4.1), S3220B2 (U2.53)
LED_3: S3220B1 (D3.1), S3220B2 (U2.54)
MODEM_LVL_SHF_EN: S3220B2 (U2.65), S3220B3 (U6.8 U7.8)
MODEM_PSM_IND: S3220B2 (U2.98), S3220B3 (Q11.3 R62.2)
MODEM_STATUS: S3220B2 (U2.1), S3220B3 (Q8.3 R58.2)
MODEM_VDD_PWR_CTRL: S3220B2 (U2.66), S3220B3 (Q10.4 R60.1)
MUX_SEL: S3220B2 (U2.33), S3220B4 (U13.1)
nACC_INT1: S3220B2 (U2.38), S3220B4 (R82.2 U12.11)
nACC_INT2: S3220B2 (U2.39), S3220B4 (R83.2 U12.9)
nBLE_PWR_CTRL: S3220B2 (U2.91), S3220B4 (Q16.1 R74.1)
nCPU_NSS_RFID: S3220B1 (CN6.4), S3220B2 (M1.11 U2.81)
nCPU_NSS_SD: S3220B1 (R20.1), S3220B2 (U2.77)
nCPU_RST_RFID: S3220B1 (CN6.3), S3220B2 (U2.41)
nFLASH_CS_CPU: S3220B2 (U2.29), S3220B4 (U13.3)
nGPS_BCKP_CTRL: S3220B2 (U2.87), S3220B4 (Q15.1 R67.1)
nGPS_PWR_CTRL: S3220B2 (U2.88), S3220B4 (Q14.1 R66.1)
nMODEM_PON_TRIG: S3220B2 (U2.97), S3220B3 (Q13.1 R61.1)
nMODEM_PWRKEY: S3220B2 (U2.3), S3220B3 (Q9.1)
nMODEM_RESET: S3220B2 (U2.2), S3220B3 (Q12.1)
nMUX_EN: S3220B2 (U2.34), S3220B4 (U13.15)
nRFID_PWR_CTRL: S3220B1 (Q3.1 R21.2), S3220B2 (U2.44)
nSD_PWR_CTRL: S3220B1 (Q1.1 R7.2), S3220B2 (U2.7)
nSWITCH_1: S3220B1 (C3.2 R8.1 SW1.1), S3220B2 (U2.43)
nSWITCH_2: S3220B1 (C4.2 R9.1 SW1.3), S3220B2 (U2.42)
QWIIC_PWR_CTRL: S3220B1 (Q2.1 R10.1), S3220B2 (U2.64)
USB_DM: S3220B1 (U1.1), S3220B2 (R30.1)
USB_DP: S3220B1 (U1.3), S3220B2 (R31.1)
USB_INT: S3220B1 (R3.1), S3220B2 (U2.4)
VBUS_AIN: S3220B1 (R3.2 R4.1), S3220B2 (M1.9 U2.36)

## Assembly variants
S3220B_A: not fitted C26 C27 C28 C29 C30 CN5 CN10 D7 L1 Q2 R6 R10 R11 R12 R13 R14 R15 R16 R29 R36 R41 R42 R44 R45 R46 R54 R56 R57 R65 U3